# EAGLE design ETHERBEAR (EAGLE 9.6.2)

## Sheet 1 of 4
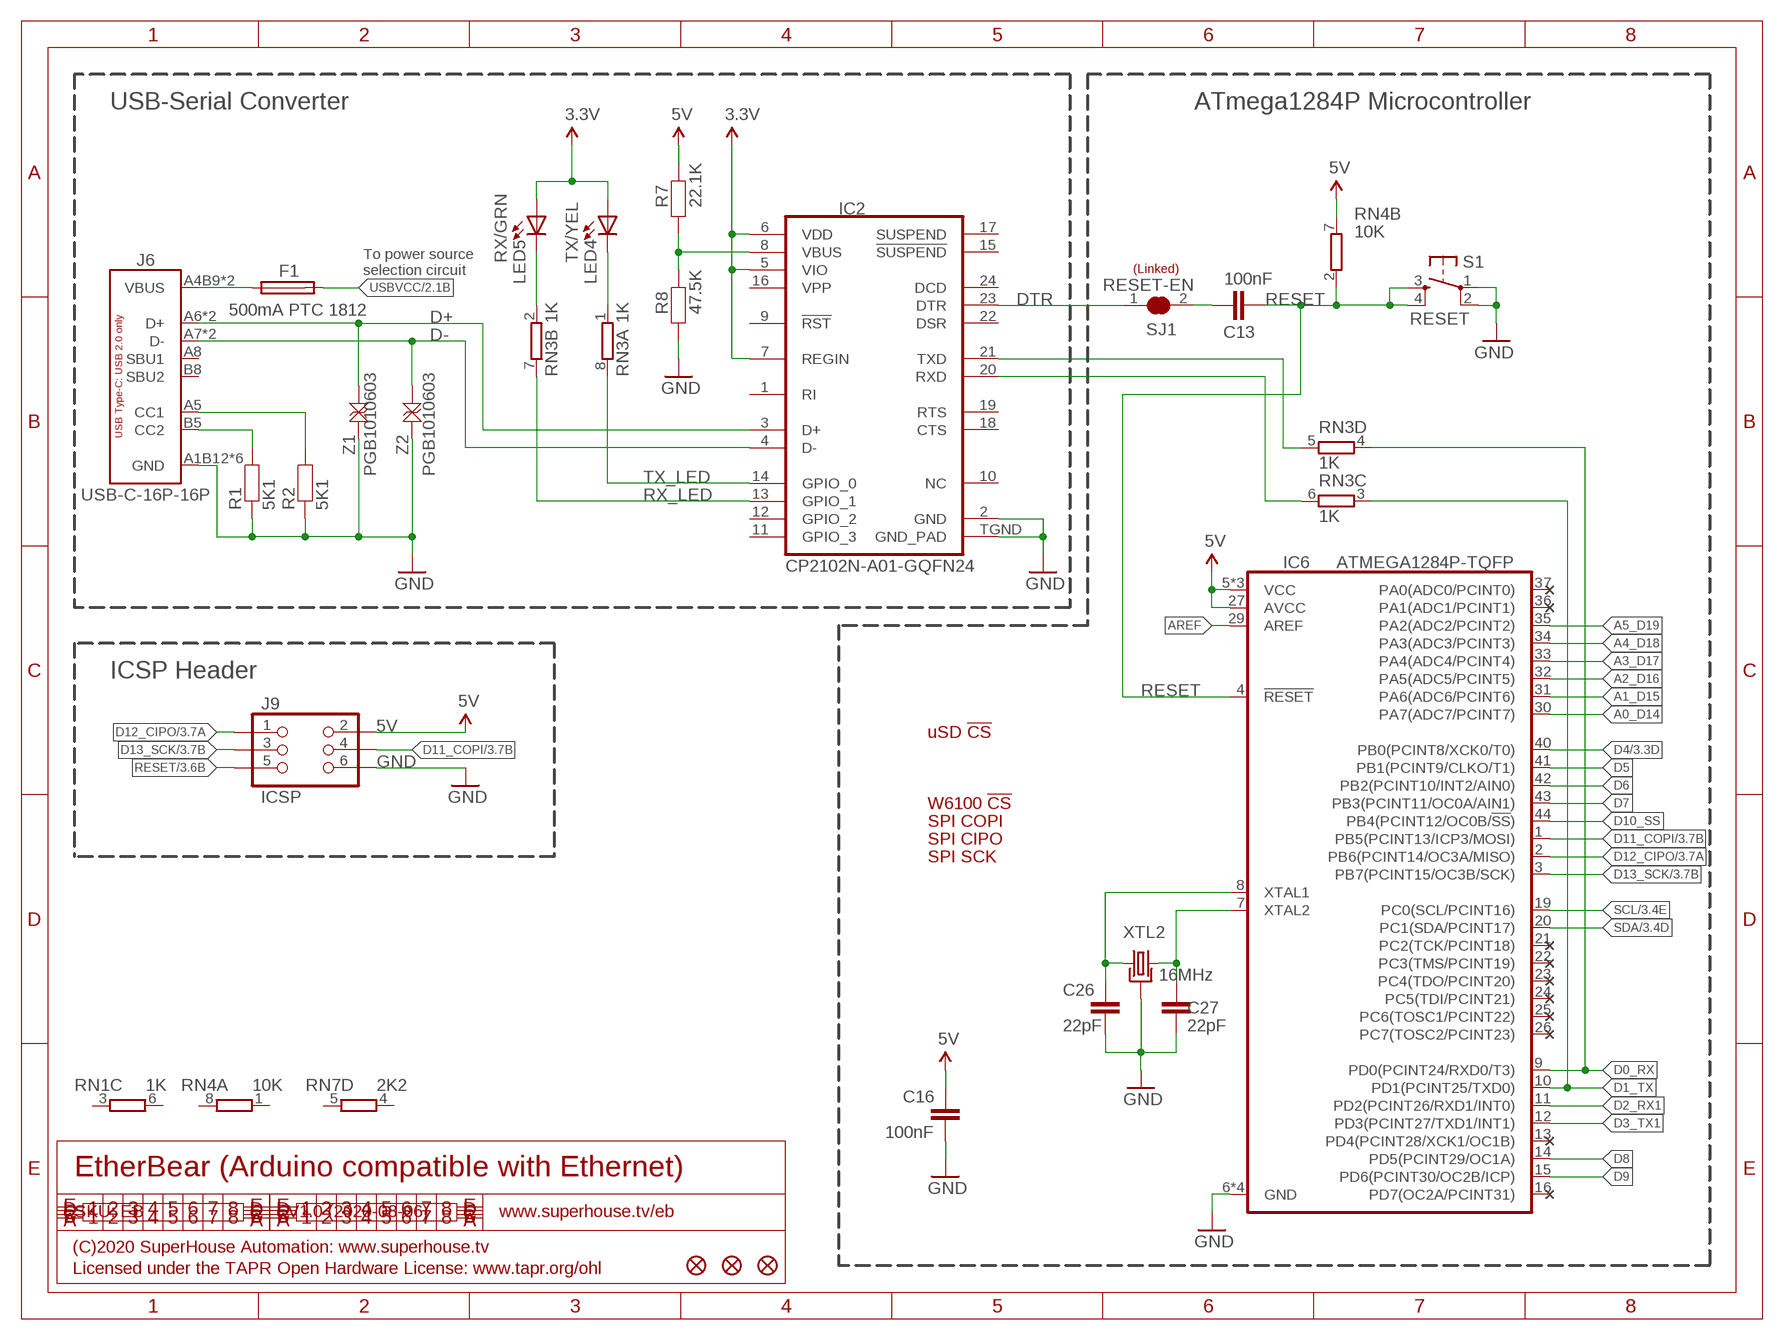
[diagram p0: schematic, sheet 1]

### Parts
C13  100nF  CAP0603  [C0603]
C16  100nF  CAP0603  [C0603]
C26  22pF  CAP0603  [C0603]
C27  22pF  CAP0603  [C0603]
F1  500mA PTC 1812  PTC050  [1812]
FID1  FIDUCIAL1X2.5  [FIDUCIAL-1X2.5]
FID2  FIDUCIAL1X2.5  [FIDUCIAL-1X2.5]
FID3  FIDUCIAL1X2.5  [FIDUCIAL-1X2.5]
IC2  CP2102N-A01-GQFN24  CP2104  [QFN-24]
IC6  ATMEGA1284P-TQFP  [TQFP44]
J6  USB-C-16P-16P  [USB-C-16P]
J9  ICSP  ICSP-PIN  [2X03-ICSP]
LED4  TX/YEL  LED0603  [LED-0603]
LED5  RX/GRN  LED0603  [LED-0603]
R1  5K1  RESISTOR0603  [R0603]
R2  5K1  RESISTOR0603  [R0603]
R7  22.1K  RESISTOR0603  [R0603]
R8  47.5K  RESISTOR0603  [R0603]
RN1  1K  4R-NCAY16  [CAY16]
RN3  1K  4R-NCAY16  [CAY16]
RN4  10K  4R-NCAY16  [CAY16]
RN7  2K2  4R-NCAY16  [CAY16]
S1  RESET  TAC_SWITCH-SMT-6  [TACTILE_SMT-6MM]
SJ1  RESET-EN  SJC-NORMAL  [SJC]
XTL2  16MHz  CRYSTAL-GND3X2  [CRYSTAL-SMD-3X2]
Z1  PGB1010603  TVS0603  [TVS0603]
Z2  PGB1010603  TVS0603  [TVS0603]

### Nets
3.3V: IC2.5(VIO) IC2.6(VDD) IC2.7(REGIN) LED4.A LED5.A ; also sheet 2,3,4
5V [power]: C16.1 IC6.5(VCC) IC6.17(VCC) IC6.27(AVCC) IC6.28(VCC) J9.2 R7.2 RN4.7 ; also sheet 2,3,4
A0_D14: IC6.30(PA7(ADC7/PCINT7)) ; also sheet 4
A1_D15: IC6.31(PA6(ADC6/PCINT6)) ; also sheet 4
A2_D16: IC6.32(PA5(ADC5/PCINT5)) ; also sheet 4
A3_D17: IC6.33(PA4(ADC4/PCINT4)) ; also sheet 4
A4_D18: IC6.34(PA3(ADC3/PCINT3)) ; also sheet 4
A5_D19: IC6.35(PA2(ADC2/PCINT2)) ; also sheet 4
AREF: IC6.29(AREF) ; also sheet 4
D0_RX: IC6.9(PD0(PCINT24/RXD0/T3)) RN3.4 ; also sheet 4
D1_TX: IC6.10(PD1(PCINT25/TXD0)) RN3.3 ; also sheet 4
D2_RX1: IC6.11(PD2(PCINT26/RXD1/INT0)) ; also sheet 4
D3_TX1: IC6.12(PD3(PCINT27/TXD1/INT1)) ; also sheet 4
D4: IC6.40(PB0(PCINT8/XCK0/T0)) ; also sheet 3,4
D5: IC6.41(PB1(PCINT9/CLKO/T1)) ; also sheet 4
D6: IC6.42(PB2(PCINT10/INT2/AIN0)) ; also sheet 4
D7: IC6.43(PB3(PCINT11/OC0A/AIN1)) ; also sheet 4
D8: IC6.14(PD5(PCINT29/OC1A)) ; also sheet 4
D9: IC6.15(PD6(PCINT30/OC2B/ICP)) ; also sheet 4
D10_SS: IC6.44(PB4(PCINT12/OC0B/!SS!))
D11_COPI: IC6.1(PB5(PCINT13/ICP3/MOSI)) J9.4 ; also sheet 3,4
D12_CIPO: IC6.2(PB6(PCINT14/OC3A/MISO)) J9.1 ; also sheet 3,4
D13_SCK: IC6.3(PB7(PCINT15/OC3B/SCK)) J9.3 ; also sheet 3,4
D+: IC2.3(D+) J6.A6(D+) J6.B6(D+) Z1.1
D-: IC2.4(D-) J6.A7(D-) J6.B7(D-) Z2.1
DTR: IC2.23(DTR) SJ1.1
GND: C16.2 C26.1 C27.1 IC2.2(GND) IC2.TGND(GND_PAD) IC6.6(GND) IC6.18(GND) IC6.38(GND) IC6.39(GND) J6.A1B12(GND) J6.A12B1(GND) J6.FIX1(GND) J6.FIX2(GND) J6.FIX3(GND) J6.FIX4(GND) J9.6 R1.1 R2.1 R8.1 S1.1 S1.2 XTL2.2(GND) XTL2.4(GND) Z1.2 Z2.2 ; also sheet 2,3,4
N$2: C26.2 IC6.8(XTAL1) XTL2.1
N$3: C13.1 SJ1.2
N$7: C27.2 IC6.7(XTAL2) XTL2.3
N$10: J6.B5(CC2) R1.2
N$11: LED5.C RN3.2
N$13: LED4.C RN3.1
N$34: J6.A5(CC1) R2.2
N$39: IC2.8(VBUS) R7.1 R8.2
N$115: F1.1 J6.A4B9(VBUS) J6.A9B4(VBUS)
RESET: C13.2 IC6.4(!RESET) J9.5 RN4.2 S1.3 S1.4 ; also sheet 3,4
RX_LED: IC2.13(GPIO_1) RN3.7
SCL: IC6.19(PC0(SCL/PCINT16)) ; also sheet 3,4
SDA: IC6.20(PC1(SDA/PCINT17)) ; also sheet 3,4
TX_LED: IC2.14(GPIO_0) RN3.8
USBRXD: IC2.21(TXD) RN3.5
USBTXD: IC2.20(RXD) RN3.6
USBVCC: F1.2 ; also sheet 2
Unconnected: IC2.1(RI) IC2.9(!RST) IC2.10(NC) IC2.11(GPIO_3) IC2.12(GPIO_2) IC2.15(!SUSPEND) IC2.16(VPP) IC2.17(SUSPEND) IC2.18(CTS) IC2.19(RTS) IC2.22(DSR) IC2.24(DCD) IC6.13(PD4(PCINT28/XCK1/OC1B)) IC6.16(PD7(OC2A/PCINT31)) IC6.21(PC2(TCK/PCINT18)) IC6.22(PC3(TMS/PCINT19)) IC6.23(PC4(TDO/PCINT20)) IC6.24(PC5(TDI/PCINT21)) IC6.25(PC6(TOSC1/PCINT22)) IC6.26(PC7(TOSC2/PCINT23)) IC6.36(PA1(ADC1/PCINT1)) IC6.37(PA0(ADC0/PCINT0)) J6.A8(SBU1) J6.B8(SBU2) RN1.3 RN1.6 RN4.1 RN4.8 RN7.4 RN7.5

### Notes on the sheet
- USB-Serial Converter | ATmega1284P Microcontroller
- (Linked)
- To power source
  selection circuit
- ICSP Header
- uSD !CS
- W6100 !CS
- SPI COPI
- SPI CIPO
- SPI SCK
- EtherBear (Arduino compatible with Ethernet)
- SKU: EB | V1.0 (2020-08-06) | www.superhouse.tv/eb
- (C)2020 SuperHouse Automation: www.superhouse.tv
- Licensed under the TAPR Open Hardware License: www.tapr.org/ohl

## Sheet 2 of 4
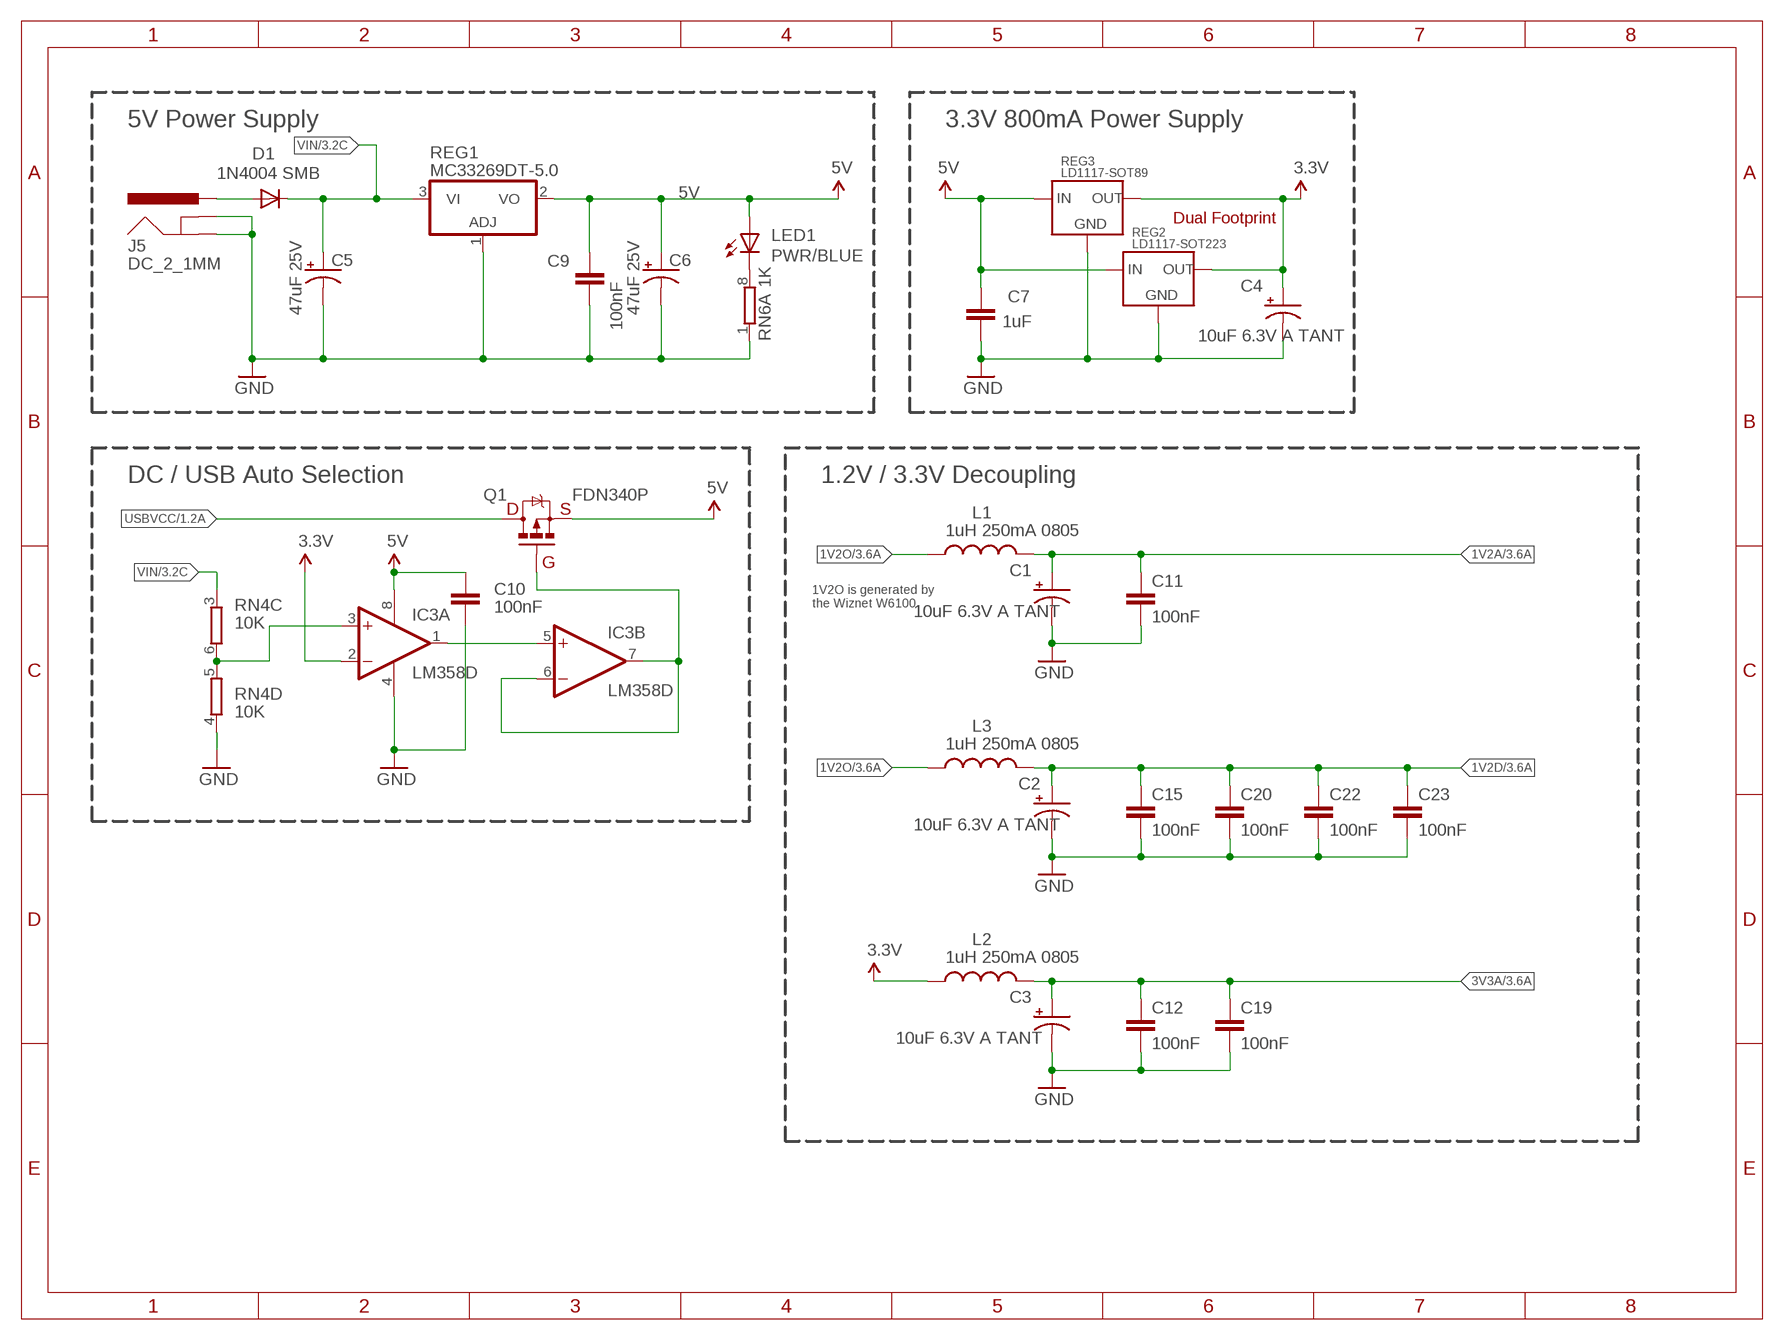
[diagram p1: schematic, sheet 2]

### Parts
C1  10uF 6.3V A TANT  CAP_POL1206  [EIA3216]
C2  10uF 6.3V A TANT  CAP_POL1206  [EIA3216]
C3  10uF 6.3V A TANT  CAP_POL1206  [EIA3216]
C4  10uF 6.3V A TANT  CAP_POL1206  [EIA3216]
C5  47uF 25V  CAP_POLD  [PANASONIC_D]
C6  47uF 25V  CAP_POLD  [PANASONIC_D]
C7  1uF  CAP0603  [C0603]
C9  100nF  CAP0603  [C0603]
C10  100nF  CAP0603  [C0603]
C11  100nF  CAP0603  [C0603]
C12  100nF  CAP0603  [C0603]
C15  100nF  CAP0603  [C0603]
C19  100nF  CAP0603  [C0603]
C20  100nF  CAP0603  [C0603]
C22  100nF  CAP0603  [C0603]
C23  100nF  CAP0603  [C0603]
D1  1N4004 SMB  DIODESMA  [SMA-DIODE]
IC3  LM358D  [SO08]
J5  DC_2_1MM  POWER_JACK-SLOTS  [POWER_JACK_SLOTS]
L1  1uH 250mA 0805  INDUCTOR0805-LARGE  [0805-LARGE]
L2  1uH 250mA 0805  INDUCTOR0805-LARGE  [0805-LARGE]
L3  1uH 250mA 0805  INDUCTOR0805-LARGE  [0805-LARGE]
LED1  PWR/BLUE  LED0603  [LED-0603]
Q1  FDN340P  MOSFET-PCHANNEL  [SOT23]
REG1  MC33269DT-5.0  MC33269-X-5.0-D  [DPACK]
REG2  LD1117-SOT223  [SOT-223]
REG3  LD1117-SOT89  [SOT89]
RN6  1K  4R-NCAY16  [CAY16]

### Nets
1V2A: C1.A(+) C11.1 L1.2 ; also sheet 3
1V2D: C2.A(+) C15.1 C20.1 C22.1 C23.1 L3.2 ; also sheet 3
1V2O: L1.1 L3.1 ; also sheet 3
3.3V: C4.A(+) IC3.2(A:-IN) L2.1 REG2.2(OUT) REG2.4(OUT) REG3.2(OUT) REG3.4(OUT) ; also sheet 1,3,4
3V3A: C3.A(+) C12.1 C19.1 L2.2 ; also sheet 3
5V [power]: C6.+ C7.1 C9.1 C10.1 IC3.8(P:V+) LED1.A Q1.2(S) REG1.2(VO) REG2.3(IN) REG3.3(IN) ; also sheet 1,3,4
GND: C1.C(-) C2.C(-) C3.C(-) C4.C(-) C5.- C6.- C7.2 C9.2 C10.2 C11.2 C12.2 C15.2 C19.2 C20.2 C22.2 C23.2 IC3.4(P:V-) J5.GND J5.GNDBREAK REG1.1(ADJ) REG2.1(GND) REG3.1(GND) RN4.4 RN6.1 ; also sheet 1,3,4
N$12: IC3.3(A:+IN) RN4.5 RN4.6
N$14: LED1.C RN6.8
N$18: IC3.6(B:-IN) IC3.7(B:OUT) Q1.1(G)
N$19: IC3.1(A:OUT) IC3.5(B:+IN)
N$60: D1.A J5.PWR
USBVCC: Q1.3(D) ; also sheet 1
VIN: C5.+ D1.C REG1.3(VI) RN4.3 ; also sheet 3,4

### Notes on the sheet
- 5V Power Supply | 3.3V 800mA Power Supply
- Dual Footprint
- DC / USB Auto Selection | 1.2V / 3.3V Decoupling
- D | S
- G
- 1V2O is generated by
  the Wiznet W6100

## Sheet 3 of 4
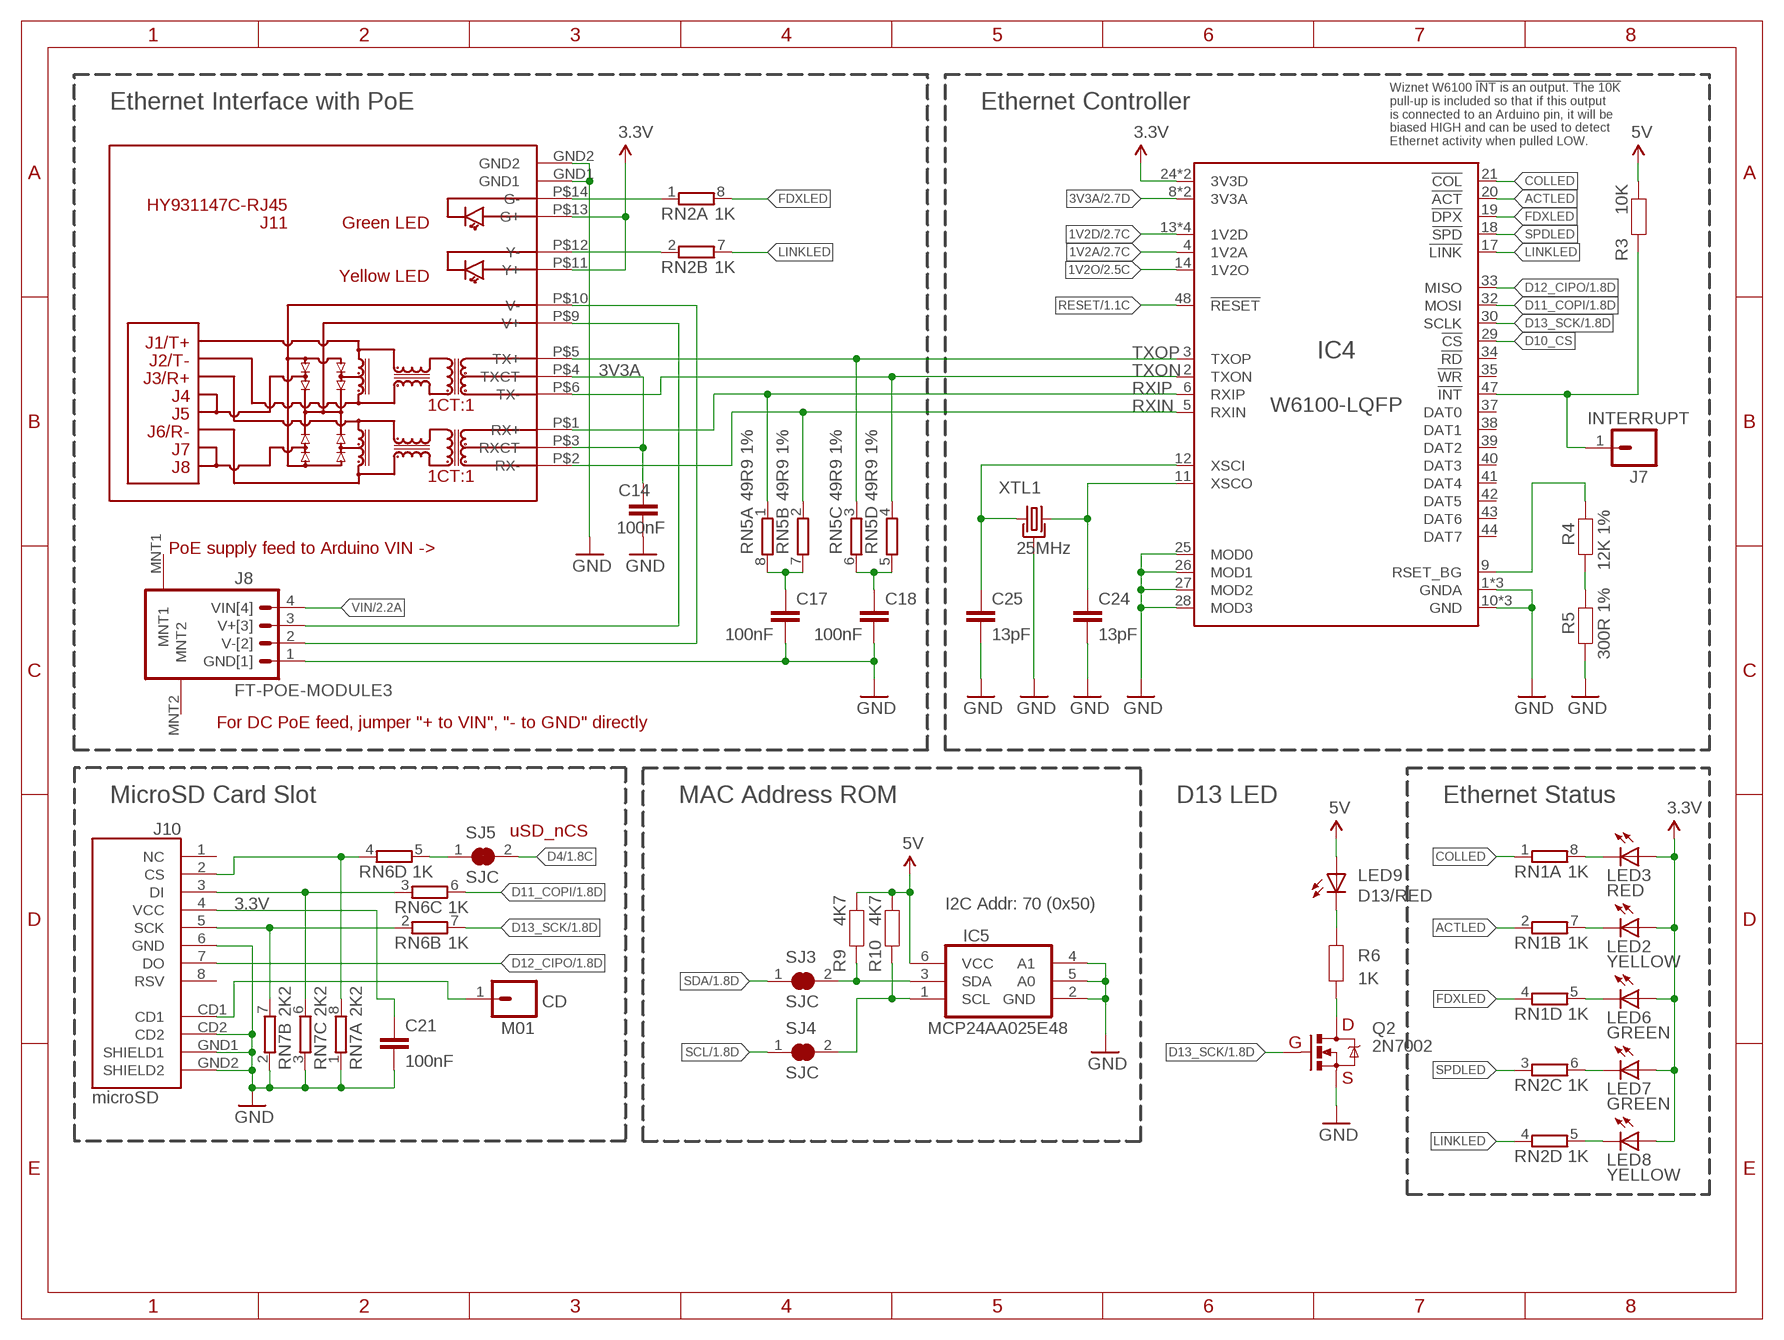
[diagram p2: schematic, sheet 3]

### Parts
C14  100nF  CAP0603  [C0603]
C17  100nF  CAP0603  [C0603]
C18  100nF  CAP0603  [C0603]
C21  100nF  CAP0603  [C0603]
C24  13pF  CAP0603  [C0603]
C25  13pF  CAP0603  [C0603]
CD  M01  M01-PLAIN  [1X01]
IC4  W6100-LQFP  [LQFP48]
IC5  MCP24AA025E48  [SOT23-6]
J7  INTERRUPT  M01-PLAIN  [1X01]
J8  FT-POE-MODULE3  [FT-POE-MODULE-NOLABEL]
J10  microSD  USD-SOCKETNEW  [MICRO-SD-SOCKET-PP]
J11  HY931147C-RJ45  [HY931147C]
LED2  YELLOW  LED0603  [LED-0603]
LED3  RED  LED0603  [LED-0603]
LED6  GREEN  LED0603  [LED-0603]
LED7  GREEN  LED0603  [LED-0603]
LED8  YELLOW  LED0603  [LED-0603]
LED9  D13/RED  LED0603  [LED-0603]
Q2  2N7002  MOSFET-NCHANNEL-233  [SOT23-3]
R3  10K  RESISTOR0603  [R0603]
R4  12K 1%  RESISTOR0603  [R0603]
R5  300R 1%  RESISTOR0603  [R0603]
R6  1K  RESISTOR0603  [R0603]
R9  4K7  RESISTOR0603  [R0603]
R10  4K7  RESISTOR0603  [R0603]
RN2  1K  4R-NCAY16  [CAY16]
RN5  49R9 1%  4R-NCAY16  [CAY16]
SJ3  SJC  SJC-NORMAL  [SJC]
SJ4  SJC  SJC-NORMAL  [SJC]
SJ5  SJC  SJC-NORMAL  [SJC]
XTL1  25MHz  CRYSTAL-GND3X2  [CRYSTAL-SMD-3X2]

### Nets
1V2A: IC4.4(1V2A) ; also sheet 2
1V2D: IC4.13(1V2D) IC4.22(1V2D) IC4.31(1V2D) IC4.45(1V2D) ; also sheet 2
1V2O: IC4.14(1V2O) ; also sheet 2
3.3V: C21.1 IC4.24(3V3D) IC4.36(3V3D) J10.4(VCC) J11.P$11(Y+) J11.P$13(G+) LED2.A LED3.A LED6.A LED7.A LED8.A ; also sheet 1,2,4
3V3A: C14.1 IC4.8(3V3A) IC4.15(3V3A) J11.P$3(RXCT) J11.P$4(TXCT) ; also sheet 2
5V [power]: IC5.6(VCC) LED9.A R3.1 R9.1 R10.1 ; also sheet 1,2,4
ACTLED: IC4.20(!ACT) RN1.2
COLLED: IC4.21(!COL) RN1.1
D4: SJ5.2 ; also sheet 1,4
D10_CS: IC4.29(!CS) ; also sheet 4
D11_COPI: IC4.32(MOSI) RN6.6 ; also sheet 1,4
D12_CIPO: IC4.33(MISO) J10.7(DO) ; also sheet 1,4
D13_SCK: IC4.30(SCLK) Q2.1(G) RN6.7 ; also sheet 1,4
FDXLED: IC4.19(!DPX) RN1.4 RN2.8
GND: C14.2 C17.2 C18.2 C21.2 C24.2 C25.2 IC4.1(GNDA) IC4.7(GNDA) IC4.10(GND) IC4.16(GNDA) IC4.23(GND) IC4.25(MOD0) IC4.26(MOD1) IC4.27(MOD2) IC4.28(MOD3) IC4.46(GND) IC5.2(GND) IC5.4(A1) IC5.5(A0) J8.1(GND[1]) J10.6(GND) J10.CD2 J10.GND1(SHIELD1) J10.GND2(SHIELD2) J11.GND1 J11.GND2 Q2.2(S) R5.2 RN7.1 RN7.2 RN7.3 XTL1.2(GND) XTL1.4(GND) ; also sheet 1,2,4
LINKLED: IC4.17(!LINK) RN2.4 RN2.7
N$1: C18.1 RN5.5 RN5.6
N$4: LED9.C R6.2
N$5: IC5.1(SCL) R10.2 SJ4.2
N$6: Q2.3(D) R6.1
N$8: LED3.C RN1.8
N$9: IC4.47(!INT) J7.1 R3.2
N$20: J10.2(CS) RN6.4 RN7.8
N$23: CD.1 J10.CD1
N$24: J10.5(SCK) RN6.2 RN7.7
N$25: J10.3(DI) RN6.3 RN7.6
N$26: LED7.C RN2.6
N$27: RN6.5 SJ5.1
N$28: LED8.C RN2.5
N$29: IC5.3(SDA) R9.2 SJ3.2
N$30: C24.1 IC4.11(XSCO) XTL1.3
N$32: C25.1 IC4.12(XSCI) XTL1.1
N$35: R4.2 R5.1
N$36: IC4.9(RSET_BG) R4.1
N$67: J11.P$14(G-) RN2.1
N$68: J8.3(V+[3]) J11.P$9(V+)
N$69: J8.2(V-[2]) J11.P$10(V-)
N$321: C17.1 RN5.7 RN5.8
N$327: LED6.C RN1.5
N$329: LED2.C RN1.7
N$332: J11.P$12(Y-) RN2.2
RESET: IC4.48(!RESET) ; also sheet 1,4
RXIN: IC4.5(RXIN) J11.P$2(RX-) RN5.2
RXIP: IC4.6(RXIP) J11.P$1(RX+) RN5.1
SCL: SJ4.1 ; also sheet 1,4
SDA: SJ3.1 ; also sheet 1,4
SPDLED: IC4.18(!SPD) RN2.3
TXON: IC4.2(TXON) J11.P$6(TX-) RN5.4
TXOP: IC4.3(TXOP) J11.P$5(TX+) RN5.3
VIN: J8.4(VIN[4]) ; also sheet 2,4
Unconnected: IC4.34(!RD) IC4.35(!WR) IC4.37(DAT0) IC4.38(DAT1) IC4.39(DAT2) IC4.40(DAT3) IC4.41(DAT4) IC4.42(DAT5) IC4.43(DAT6) IC4.44(DAT7) J8.MNT1 J8.MNT2 J10.1(NC) J10.8(RSV)

### Notes on the sheet
- Ethernet Interface with PoE | Ethernet Controller
- Wiznet W6100 !INT is an output. The 10K
  pull-up is included so that if this output
  is connected to an Arduino pin, it will be
  biased HIGH and can be used to detect
  Ethernet activity when pulled LOW.
- PoE supply feed to Arduino VIN ->
- For DC PoE feed, jumper "+ to VIN", "- to GND" directly
- MicroSD Card Slot | MAC Address ROM | D13 LED | Ethernet Status
- uSD_nCS
- I2C Addr: 70 (0x50)
- D
- G
- S

## Sheet 4 of 4
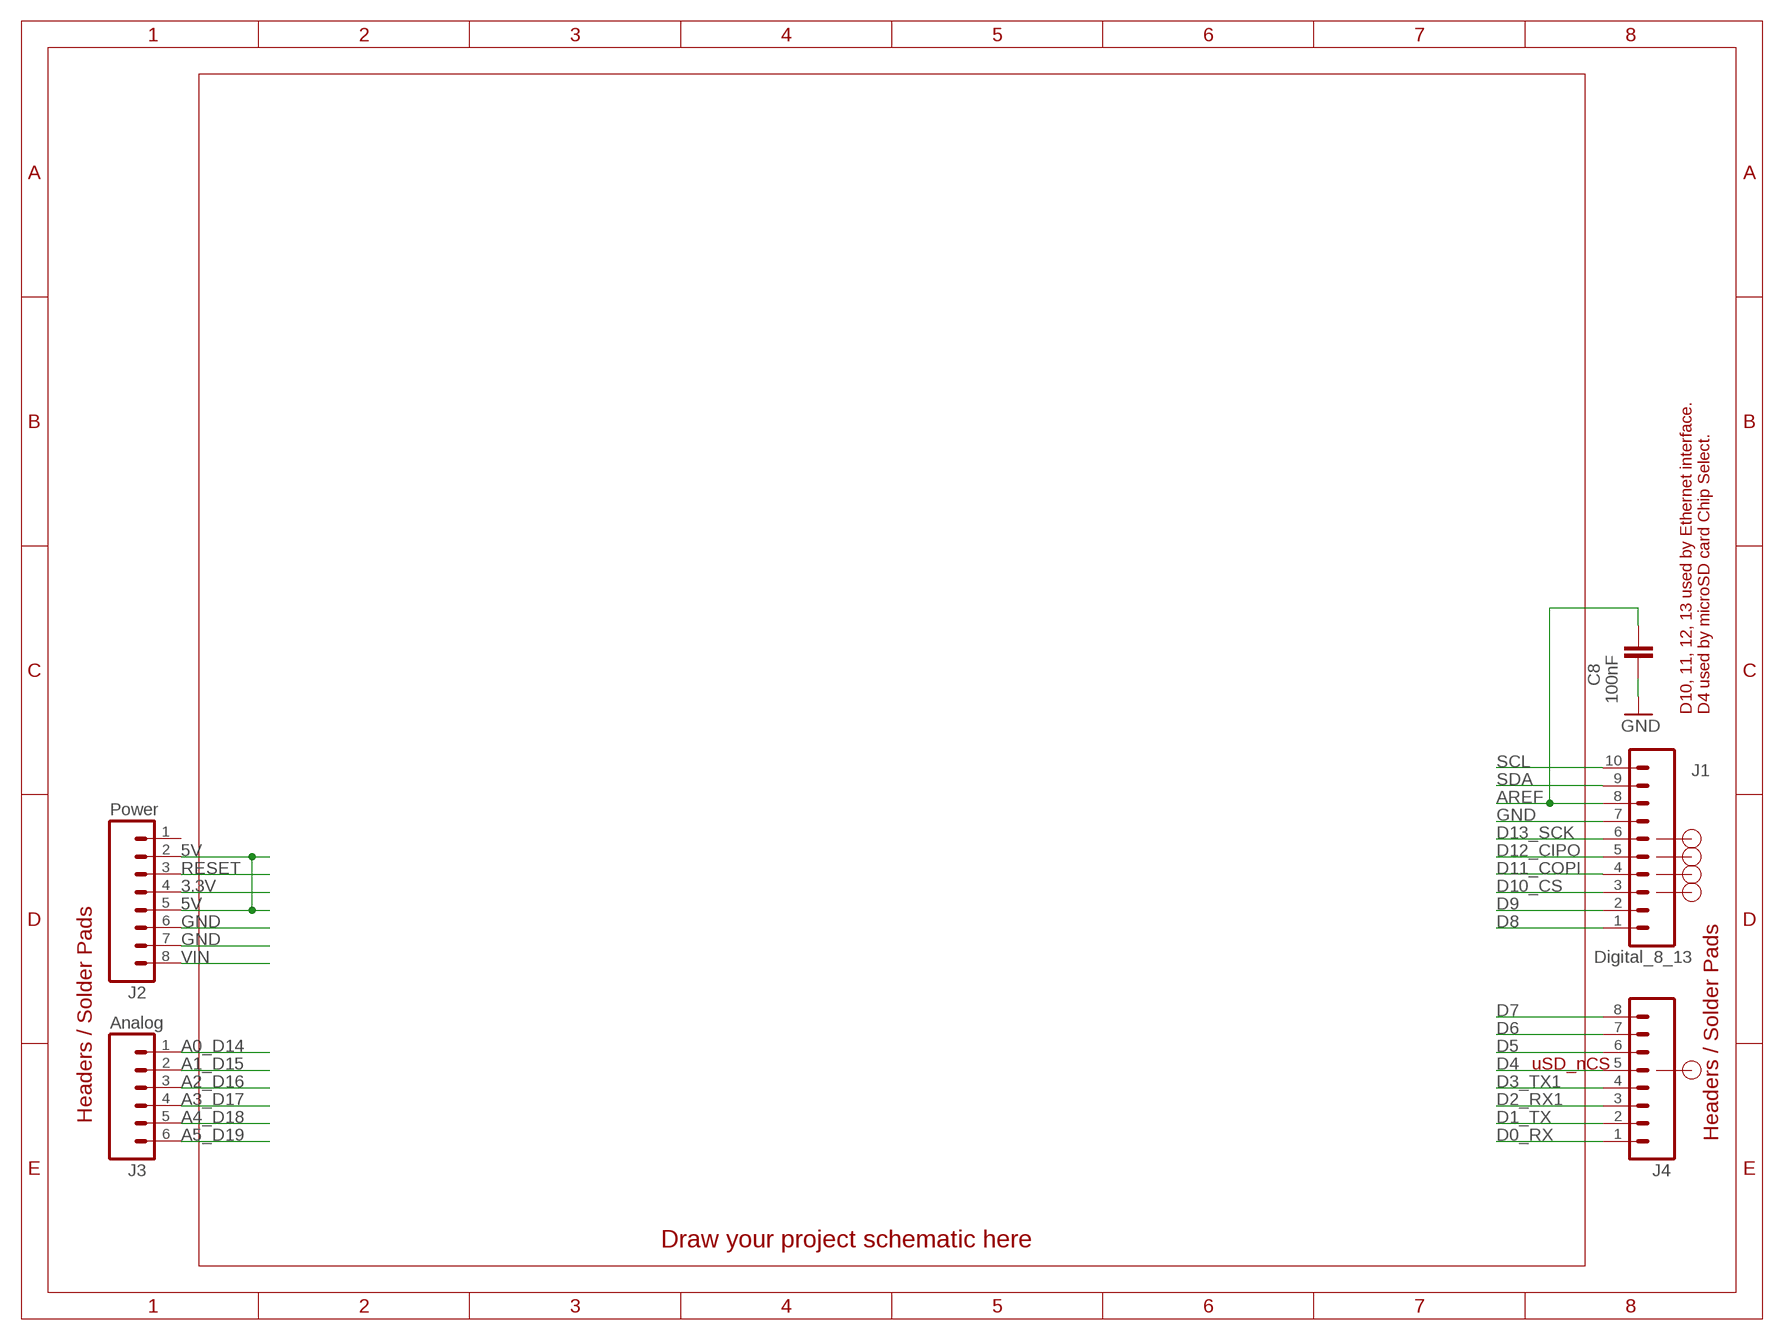
[diagram p3: schematic, sheet 4]

### Parts
C8  100nF  CAP0603  [C0603]
J1  Digital_8_13  M10-SOCKET  [1X10-S]
J2  Power  M08-SOCKET  [1X08-S]
J3  Analog  M06-SOCKET  [1X06-S]
J4  Digital_0_7  M08-SOCKET  [1X08-S]

### Nets
3.3V: J2.4 ; also sheet 1,2,3
5V [power]: J2.2 J2.5 ; also sheet 1,2,3
A0_D14: J3.1 ; also sheet 1
A1_D15: J3.2 ; also sheet 1
A2_D16: J3.3 ; also sheet 1
A3_D17: J3.4 ; also sheet 1
A4_D18: J3.5 ; also sheet 1
A5_D19: J3.6 ; also sheet 1
AREF: C8.1 J1.8 ; also sheet 1
D0_RX: J4.1 ; also sheet 1
D1_TX: J4.2 ; also sheet 1
D2_RX1: J4.3 ; also sheet 1
D3_TX1: J4.4 ; also sheet 1
D4: J4.5 ; also sheet 1,3
D5: J4.6 ; also sheet 1
D6: J4.7 ; also sheet 1
D7: J4.8 ; also sheet 1
D8: J1.1 ; also sheet 1
D9: J1.2 ; also sheet 1
D10_CS: J1.3 ; also sheet 3
D11_COPI: J1.4 ; also sheet 1,3
D12_CIPO: J1.5 ; also sheet 1,3
D13_SCK: J1.6 ; also sheet 1,3
GND: C8.2 J1.7 J2.6 J2.7 ; also sheet 1,2,3
RESET: J2.3 ; also sheet 1,3
SCL: J1.10 ; also sheet 1,3
SDA: J1.9 ; also sheet 1,3
VIN: J2.8 ; also sheet 2,3
Unconnected: J2.1

### Notes on the sheet
- D10, 11, 12, 13 used by Ethernet interface. | D4 used by microSD card Chip Select.
- uSD_nCS
- Headers / Solder Pads
- Headers / Solder Pads
- Draw your project schematic here

## Library data of the parts
C1-C6 = SuperHouse-DiscreteSemi:CAP_POL: Capacitor Polarized These are standard SMD and PTH capacitors. Normally 10uF, 47uF, and 100uF in electrolytic and tantalum varieties. Always verify the external diameter of the through hole cap, it varies with capacity, voltage, and manufacturer. The EIA devices should be standard.
C7-C27 = SuperHouse-DiscreteSemi:CAP: Capacitor Standard ceramic capacitor
CD J7 = SuperHouse-Connectors:M01: 1-way header Standard 1x1 header
D1 = SuperHouse-DiscreteSemi:DIODE: Diode Standard reverse protection diodes and small signal diodes. SMA package can handle up to about 1A. SOD-323 can handle about 200mA.
F1 = SuperHouse-Fuses:PTC: MF-SMDF Series - PRC Resettable Fuses Source: http://www.farnell.com/datasheets/716597.pdf
FID1-FID3 = SuperHouse-Symbols:FIDUCIAL: Fiducial Alignment Points Various fiducial points for machine vision alignment.
IC2 = SuperHouse-ICs:CP2104: CP2104 / CP2102N-A01-GQFN24 CP2104 USB to serial converter. The CP2104 is not recommended for new designs: replace with CP2102N-A01-GQFN24.
IC3 = linear:LM358: OP AMP also LM158; LM258; LM2904 Source: http://cache.national.com/ds/LM/LM158.pdf
IC4 = SuperHouse-ICs:W6100: Wiznet W6100 Ethernet controller
IC5 = freetronics-jon:MCP24AA025E48
IC6 = SuperHouse-MCUs:ATMEGA1284P: Microchip ATmega1284P AVR MCU
J1 = SuperHouse-Connectors:M10: 10-way header Standard 1x10 header, and screw terminal variations
J2 J4 = SuperHouse-Connectors:M08: 8-way header Standard 1x8 header, and screw terminal variations
J3 = SuperHouse-Connectors:M06: 6-way header Standard 1x6 header, and screw terminal variations
J5 = SuperHouse-Connectors:POWER_JACK: Power Jack This is the standard 5.5mm barrel jack for power. The PTH is the most common, proven, reliable, footprint. All others are experimental. The Slot footprint only works if the mill layer is transmitted to the PCB fab house so be warned. Spark Fun Electronics SKU : PRT-00119. Mating wall wart : TOL-00298 (and others)
J6 = SuperHouse-Connectors:USB-C-16P: USB-C socket with 16 pins, suitable only for backward compatibility with USB 2
J8 = freetronics-master-v1.1:FT-POE-MODULE
J9 = SuperHouse-Connectors:ICSP
J10 = SuperHouse-Connectors:USD-SOCKET: microSD Socket Push-push type uSD socket. Schematic element and footprint production proven. Spark Fun Electronics SKU : PRT-00127. tDoc lines correctly indicate media card edge positions when inserting (unlocked, locked, depressed).
J11 = SuperHouse-Connectors:HY931147C: Hanrun RJ45 socket HY931147C
L1-L3 = SuperHouse-DiscreteSemi:INDUCTOR: Inductors Basic Inductor/Choke - 0603 and 1206. Footprints are not proven and vary greatly between part numbers.
LED1-LED9 = SuperHouse-LEDs:LED: LEDs Standard schematic elements and footprints for 5mm, 3mm, 1206, and 0603 sized LEDs. 5mm - Spark Fun Electronics SKU : COM-00529 (and others)
Q1 = freetronics-master-v1:MOSFET-PCHANNEL
Q2 = SuperHouse-DiscreteSemi:MOSFET-NCHANNEL: N-channel MOSFET
R1-R10 = SuperHouse-DiscreteSemi:RESISTOR: Resistor Standard resistors.
REG1 = SuperHouse-Regulators:MC33269-X: Adjustable Output Low Dropout Voltage Regulator 800 mA Source: http://www.onsemi.com/pub/Collateral/MC33269-D.PDF
REG2 REG3 = SuperHouse-Regulators:LD1117: Fixed-voltage LD1117 series LDOs. Note that the ground pin is labelled as ground, not as adj, because it's not the adjustable-voltage part.
RN1-RN7 = SuperHouse-DiscreteSemi:4R-N: Array Chip Resistor Source: RS Component / Phycomp
S1 = SuperHouse-Switches:TAC_SWITCH: Momentary Switch Tactile switch, normally-open.
SJ1 SJ3-SJ5 = SuperHouse-Jumpers:SJC: Solder jumper. Normally closed: does not need solder to close. Can be opened by cutting the track.
XTL1 XTL2 = SuperHouse-Oscillators:CRYSTAL-GND: 3x2mm SMT crystal
Z1 Z2 = SuperHouse-DiscreteSemi:TVS: TVS voltage protection Zener

## Board
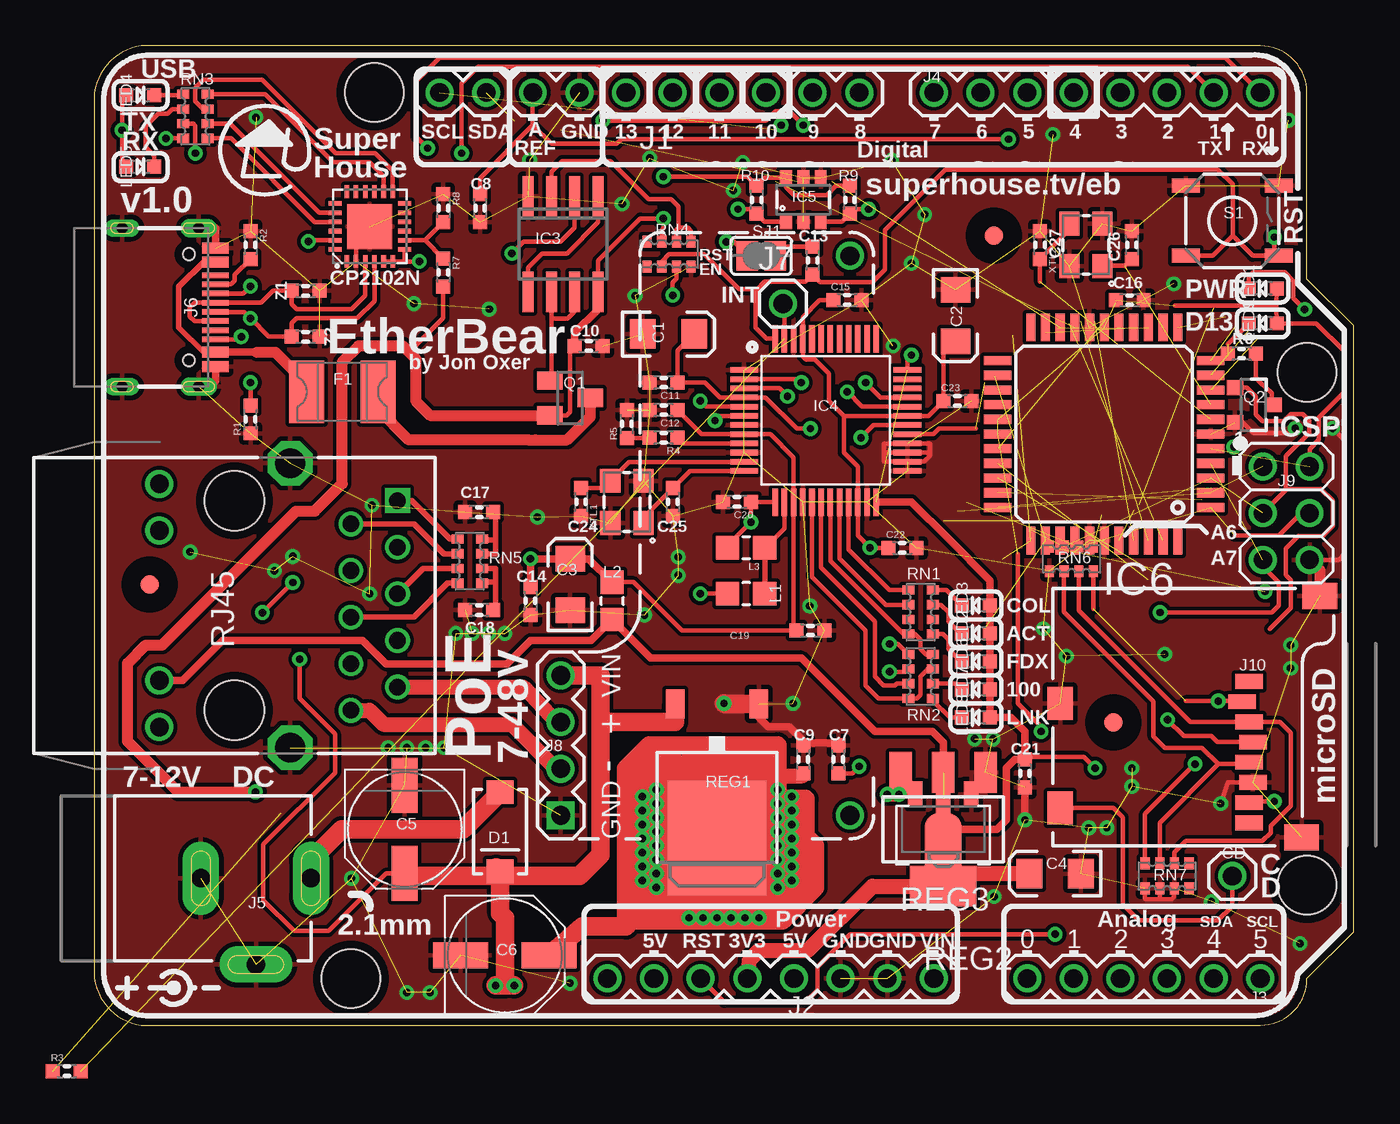
[diagram p4: board, top side]
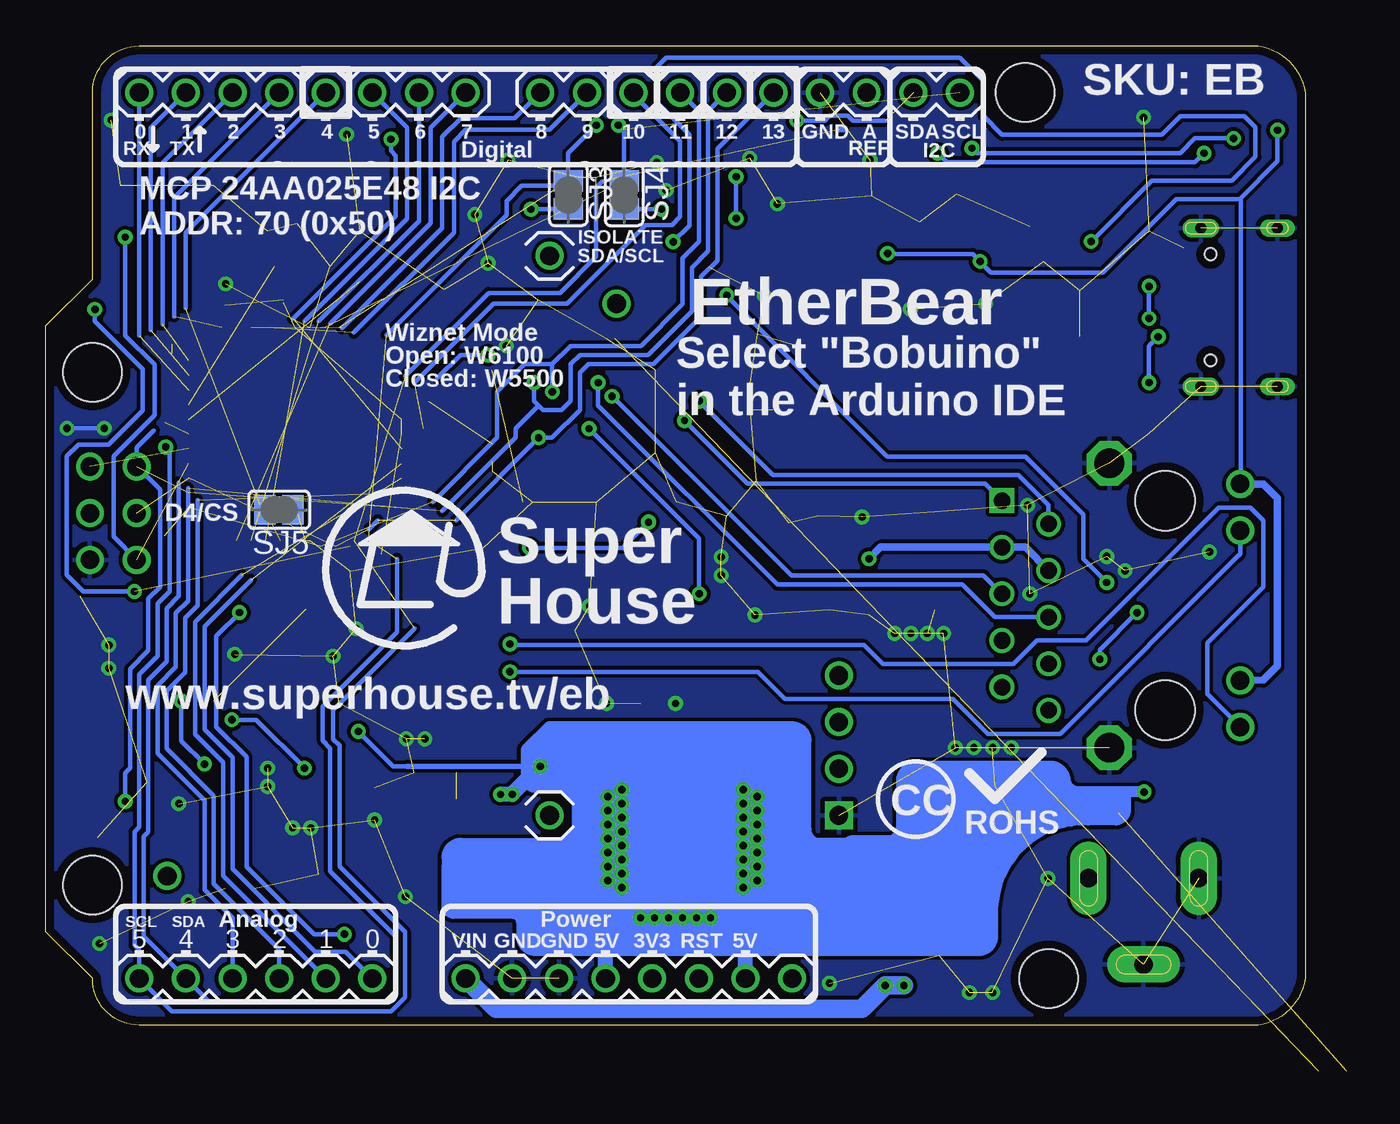
[diagram p5: board, bottom side, seen from below]

Size 68.58 x 53.34 mm. Coordinates in mm from the lower left corner, seen from the top.
Outline: 0,2.54 arc74 2.54,0 63.5,0 arc90 66.04,2.54 68.58,5.08 68.58,38.1 66.04,40.64 66.04,50.8 arc90 63.5,53.34 2.54,53.34 arc74 0,50.8 0,2.54
Copper layers (1*16): Top 0.035mm / dielectric 1.5mm / Bottom 0.035mm
Design rules "SuperHouse-Design-Rules": minimum track width 10mil, minimum drill 24mil, track to track 8mil, track to pad 8mil, pad to pad 8mil, via to via 8mil, smd to smd 6mil, copper to edge 18mil, drill to drill 8mil, minimum pad ring 7mil, minimum via ring 8mil, stop-mask expansion 4mil, vias tented up to drill 0.5mm, thermal gap 10mil
Holes 3.2 mm at 66.04,35.56 66.04,7.62 13.97,2.54 15.24,50.8
tRestrict: area 48,42 to 50,44; area 54.5,15.5 to 56.5,17.5; area 2,23 to 4,25

### Footprints (pad centres in the part's own frame; a part is rotated, then mirrored left to right if it is on the bottom)
EIA3216 = smd 1.4 x 1.6: A 1.4,0; C -1.4,0
PANASONIC_D = smd 3 x 1.4: + 2.4,0; - -2.4,0
C0603 = smd 0.762 x 0.762: 1 -0.762,0; 2 0.762,0
1X01 = drill 1.016: 1 0,0
SMA-DIODE = smd 1.27 x 1.47: A -2.15,0; C 2.15,0
1812 = smd 1.9 x 3.4: 1 -1.95,0; 2 1.95,0
FIDUCIAL-1X2.5 = smd 1 x 1: 1 0,0
QFN-24 = smd 0.25 x 0.7: 1 -1.25,-1.9; 2 -0.75,-1.9; 3 -0.25,-1.9; 4 0.25,-1.9; 5 0.75,-1.9; 6 1.25,-1.9; 13 1.25,1.9; 14 0.75,1.9; 15 0.25,1.9; 16 -0.25,1.9; 17 -0.75,1.9; 18 -1.25,1.9 | smd 0.7 x 0.25: 7 1.9,-1.25; 8 1.9,-0.75; 9 1.9,-0.25; 10 1.9,0.25; 11 1.9,0.75; 12 1.9,1.25; 19 -1.9,1.25; 20 -1.9,0.75; 21 -1.9,0.25; 22 -1.9,-0.25; 23 -1.9,-0.75; 24 -1.9,-1.25 | smd 2.45 x 2.45: TGND 0,0
SO08 = smd 0.6 x 2.2: 1 -1.905,-2.6; 2 -0.635,-2.6; 3 0.635,-2.6; 4 1.905,-2.6; 5 1.905,2.6; 6 0.635,2.6; 7 -0.635,2.6; 8 -1.905,2.6
LQFP48 = smd 1.5 x 0.3: 1 -4.45,2.75; 2 -4.45,2.25; 3 -4.45,1.75; 4 -4.45,1.25; 5 -4.45,0.75; 6 -4.45,0.25; 7 -4.45,-0.25; 8 -4.45,-0.75; 9 -4.45,-1.25; 10 -4.45,-1.75; 11 -4.45,-2.25; 12 -4.45,-2.75; 25 4.45,-2.75; 26 4.45,-2.25; 27 4.45,-1.75; 28 4.45,-1.25; 29 4.45,-0.75; 30 4.45,-0.25; 31 4.45,0.25; 32 4.45,0.75; 33 4.45,1.25; 34 4.45,1.75; 35 4.45,2.25; 36 4.45,2.75 | smd 0.3 x 1.5: 13 -2.75,-4.45; 14 -2.25,-4.45; 15 -1.75,-4.45; 16 -1.25,-4.45; 17 -0.75,-4.45; 18 -0.25,-4.45; 19 0.25,-4.45; 20 0.75,-4.45; 21 1.25,-4.45; 22 1.75,-4.45; 23 2.25,-4.45; 24 2.75,-4.45; 37 2.75,4.45; 38 2.25,4.45; 39 1.75,4.45; 40 1.25,4.45; 41 0.75,4.45; 42 0.25,4.45; 43 -0.25,4.45; 44 -0.75,4.45; 45 -1.25,4.45; 46 -1.75,4.45; 47 -2.25,4.45; 48 -2.75,4.45
SOT23-6 = smd 0.65 x 0.8: 1 -0.95,-1.2; 2 0,-1.2; 3 0.95,-1.2; 4 0.95,1.2; 5 0,1.2; 6 -0.95,1.2
TQFP44 = smd 1.5 x 0.5: 1 -5.8,4; 2 -5.8,3.2; 3 -5.8,2.4; 4 -5.8,1.6; 5 -5.8,0.8; 6 -5.8,0; 7 -5.8,-0.8; 8 -5.8,-1.6; 9 -5.8,-2.4; 10 -5.8,-3.2; 11 -5.8,-4; 23 5.8,-4; 24 5.8,-3.2; 25 5.8,-2.4; 26 5.8,-1.6; 27 5.8,-0.8; 28 5.8,0; 29 5.8,0.8; 30 5.8,1.6; 31 5.8,2.4; 32 5.8,3.2; 33 5.8,4 | smd 0.5 x 1.5: 12 -4,-5.8; 13 -3.2,-5.8; 14 -2.4,-5.8; 15 -1.6,-5.8; 16 -0.8,-5.8; 17 0,-5.8; 18 0.8,-5.8; 19 1.6,-5.8; 20 2.4,-5.8; 21 3.2,-5.8; 22 4,-5.8; 34 4,5.8; 35 3.2,5.8; 36 2.4,5.8; 37 1.6,5.8; 38 0.8,5.8; 39 0,5.8; 40 -0.8,5.8; 41 -1.6,5.8; 42 -2.4,5.8; 43 -3.2,5.8; 44 -4,5.8
1X10-S = drill 1.016: 1 -11.43,0; 2 -8.89,0; 3 -6.35,0; 4 -3.81,0; 5 -1.27,0; 6 1.27,0; 7 3.81,0; 8 6.35,0; 9 8.89,0; 10 11.43,0
1X08-S = drill 1.016: 1 -8.89,0; 2 -6.35,0; 3 -3.81,0; 4 -1.27,0; 5 1.27,0; 6 3.81,0; 7 6.35,0; 8 8.89,0
1X06-S = drill 1.016: 1 -6.35,0; 2 -3.81,0; 3 -1.27,0; 4 1.27,0; 5 3.81,0; 6 6.35,0
POWER_JACK_SLOTS = drill 1 pad 2 long: GND 0,7.7; GNDBREAK 4.7,10.7; PWR 0,13.7
USB-C-16P = smd 0.6 x 1.45: A1B12 -3.225,5.095; A4B9 -2.45,5.095; A9B4 2.45,5.095; A12B1 3.225,5.095 | smd 0.3 x 1.45: A5 -1.25,5.095; A6 -0.25,5.095; A7 0.25,5.095; A8 1.25,5.095; B5 1.75,5.095; B6 0.75,5.095; B7 -0.75,5.095; B8 -1.75,5.095 | drill 0.6 pad 0.8 long: FIX1 -4.32,0; FIX4 4.32,0 | drill 0.6 pad 1 long: FIX2 -4.32,4.18; FIX3 4.32,4.18 | hole 0.65: 2.89,3.65; -2.89,3.65
FT-POE-MODULE-NOLABEL = drill 1.016 square: 1 0,0 | drill 1.016: 2 2.54,0; 3 5.08,0; 4 7.62,0; MNT1 0,-15.748; MNT2 30.48,-15.748
2X03-ICSP = drill 1.016: 1 -2.54,-1.27; 2 -2.54,1.27; 3 0,-1.27; 4 0,1.27; 5 2.54,-1.27; 6 2.54,1.27
MICRO-SD-SOCKET-PP = smd 0.8 x 1.5: 1 -8.94,10.7; 2 -7.84,10.3; 3 -6.74,10.7; 4 -5.64,10.9; 5 -4.54,10.7; 6 -3.44,10.9; 7 -2.34,10.7; 8 -1.24,10.7 | smd 1.8 x 1.4: CD1 -2.05,0.4; CD2 -7.75,0.4 | smd 1.4 x 1.9: GND1 -0.45,13.55; GND2 -13.6,14.55
HY931147C = drill 1.63 octagon: GND1 3.05,7.745; GND2 3.05,-7.745 | drill 0.9 square: P$1 8.89,5.715 | drill 0.9: P$2 6.35,4.445; P$3 8.89,3.175; P$4 6.35,1.905; P$5 8.89,0.635; P$6 6.35,-0.635; P$7 8.89,-1.905; P$8 6.35,-3.175; P$9 8.89,-4.445; P$10 6.35,-5.715 | drill 1.016: P$11 -4.08,6.625; P$12 -4.08,4.085; P$13 -4.08,-4.085; P$14 -4.08,-6.625 | hole 3.25: 0,5.715; 0,-5.715
0805-LARGE = smd 1.27 x 1.27: 1 -1.016,0; 2 1.016,0
LED-0603 = smd 0.762 x 0.762: A -0.762,0; C 0.762,0
SOT23 = smd 1 x 1.4: 1 -0.95,-1.1; 2 0.95,-1.1; 3 0,1.1
SOT23-3 = smd 0.8 x 0.9: 1 -0.95,-1; 2 0.95,-1; 3 0,1.1
R0603 = smd 0.762 x 0.762: 1 -0.762,0; 2 0.762,0
DPACK = smd 1 x 1.6: 1 -2.28,-4.8; 3 2.28,-4.8 | smd 5.4 x 6.2: 2 0,2.5
SOT-223 = smd 1.219 x 2.235: 1 -2.311,-3.099; 2 0,-3.099; 3 2.311,-3.099 | smd 3.6 x 2.2: 4 0,3.099
SOT89 = smd 0.8 x 1.4: 1 -1.524,-1.905; 3 1.524,-1.905 | smd 0.8 x 1.9: 2 0,-1.651 | smd 2.032 x 3.65: 4 0,0.94
CAY16 = smd 0.5 x 0.65: 1 -1.2,-0.675; 2 -0.4,-0.675; 3 0.4,-0.675; 4 1.2,-0.675; 5 1.2,0.675; 6 0.4,0.675; 7 -0.4,0.675; 8 -1.2,0.675
TACTILE_SMT-6MM = smd 1.524 x 0.762: 1 -2.54,1.905; 2 2.54,1.905; 3 -2.54,-1.905; 4 2.54,-1.905
SJC = smd 1.168 x 1.6: 1 -0.762,0; 2 0.762,0
CRYSTAL-SMD-3X2 = smd 1.3 x 1.1: 1 -1.15,-0.9; 2 1.15,-0.9; 3 1.15,0.9; 4 -1.15,0.9
TVS0603 = smd 0.762 x 0.762: 1 -0.762,0; 2 0.762,0

### Placement (x,y rotation side)
C1  31.27,37.65 0 top
C2  46.9,38.65 270 top
C3  25.91,24 90 top
C4  52.32,8.26 180 top
C5  16.89,10.67 270 top
C6  22.35,3.81 0 top
C7  40.51,14.48 90 top
C8  21,44.5 270 top
C9  38.61,14.48 90 top
C10  26.92,37 0 top
C11  31,35 180 top
C12  31,33.5 180 top
C13  39.12,41.66 270 top
C14  23.75,23.11 270 top
C15  41,39.5 0 top
C16  56.38,39.49 0 top
C17  20.95,27.94 180 top
C18  20.95,22.61 180 top
C19  39,21.5 0 top
C20  35,28.5 180 top
C21  50.67,13.72 270 top
C22  44,26 0 top
C23  47,34 0 top
C24  26.5,28.5 270 top
C25  31.5,28.5 270 top
C26  56.5,42.5 270 top
C27  51.5,42.5 270 top
CD  61.98,8.13 0 top
D1  22.1,10.54 270 top
F1  13.5,34.5 0 top
FID1  49,43 0 top
FID2  55.5,16.5 0 top
FID3  3,24 0 top
IC2  15,43.5 0 top
IC3  25.53,42.55 180 top
IC4  39.83,32.94 0 top
IC5  38.61,44.96 0 top
IC6  55,32.2 180 top
J1  30.23,50.8 180 top
J2  36.83,2.54 0 top
J3  57.15,2.54 0 top
J4  54.61,50.8 180 top
J5  -1.91,8 270 top
J6  1.5,39.1 270 top
J7  37.5,39.3 0 top
J8  25.4,11.43 90 top
J9  64.91,27.89 270 top
J10  52.2,9.78 270 top
J11  7.62,22.86 0 top
L1  35.5,23.5 180 top
L2  28.19,23.11 90 top
L3  35.5,26 180 top
LED1  63.63,40.13 180 top
LED2  48.01,21.34 180 top
LED3  48.01,22.86 180 top
LED4  2.5,50.65 0 top
LED5  2.5,46.76 0 top
LED6  48.01,19.81 180 top
LED7  48.01,18.29 180 top
LED8  48.01,16.76 180 top
LED9  63.63,38.23 180 top
Q1  25.91,34.16 270 top
Q2  63.12,33.78 270 top
R1  8.5,33 90 top
R2  8.5,42.5 270 top
R3  -1.5,-2.5 0 top
R4  31,32 180 top
R5  29,32.75 90 top
R6  62.48,36.58 180 top
R7  19,41 270 top
R8  19,44.5 270 top
R9  41.15,44.96 270 top
R10  36.07,44.96 270 top
REG1  33.91,12.7 180 top
REG2  46.23,10.67 180 top
REG3  46.23,10.67 180 top
RN1  45,22.5 270 top
RN2  45,19 270 top
RN3  5.5,49.5 270 top
RN4  31.3,42 0 top
RN5  20.45,25.27 270 top
RN6  53.21,25.4 0 top
RN7  58.42,8.13 0 top
S1  61.98,43.81 0 top
SJ1  36.32,41.91 0 top
SJ3  40.13,45.21 270 bottom
SJ4  37.08,45.21 270 bottom
SJ5  55.88,28.07 180 bottom
XTL1  29,28.5 90 top
XTL2  54,42.5 90 top
Z1  11.5,40 0 top
Z2  11.5,37.5 0 top

### Tracks (layer width: path | path; a pad name or v marks a point on that pad's centre or on a via)
1V2A  (via drill 0.4)
  Top 0.254: C1.A 31.76,36.75 C11.1 33.26,35 34.07,34.19 IC4.4 36.56,34.19 38.25,32.5 v39,32.5 | L1.2 v33,23.5
  Bottom 0.254: v39,32.5 33,26.5 v33,23.5
1V2D  (via drill 0.4)
  Top 0.254: IC4.13 35.77,28.49 C20.1 v35.76,27.4 34.48,26.12 L3.2 | C15.1 39.5,39.5 38.58,38.58 IC4.45 38.58,36.42 38.75,36.25 39.25,36.25 40,35.5 40,34 40.81,33.19 | C2.A 46.24,36.59 C23.1 45.43,33.19 IC4.31 40.81,33.19 | 40.81,33.19 40.81,31.19 41.58,30.42 IC4.22 41.58,26.66 v42.24,26 C22.1
  Bottom 0.254: v35.76,27.4 37.16,26 v42.24,26
1V2O
  Top 0.254: IC4.14 37.58,27.06 L3.1
  Top 0.305: L3.1 L1.1
3.3V  (via drill 0.4)  (2 unrouted)
  Top 0.254: IC3.2 26.16,43.45 25.38,42.67 23.38,42.67 v22.74,42.04 | J10.4 61.16,15.42 60.83,15.75 59.34,15.75 v58.45,16.64 | IC2.5 IC2.6 16.9,41.6 | 16.9,41.6 v17.7,41.6 | IC2.7 16.9,41.6 | LED4.A 1.5,50.42 v1.5,48.75 1.5,46.99 LED5.A | IC4.36 44.28,36.28 v44.5,36.5 | 42.75,28.5 IC4.24 | REG3.2 46.23,13.5 | v54.5,14 53.9,14.61 50.63,14.61
  Top 0.406: J11.P$13 4.8,18.77 6.98,20.95 14.61,20.95 15.88,19.68 22.48,19.68 23.74,20.95 27.04,20.95 L2.1 30.29,20 38.5,20 42.5,16 45.63,16 46.23,15.4 46.23,13.5 | 46.23,10.67 49.15,10.67 49.66,11.18 49.66,14 50.13,14.48 C21.1 | 50.63,14.61 C21.1 | C21.1 50.67,16 49.91,16.76 LED8.A LED7.A LED6.A LED2.A LED3.A 48.77,24.23 46.5,26.5 44.5,28.5 42.75,28.5 | REG3.4 REG3.2
  Top 0.813: J2.4 35.66,3.53 36.2,4.06 38.86,4.06 42.37,7.57 REG2.4 | C4.A 46.91,8.26 REG2.4 | REG3.4 REG2.4 | REG3.4 46.23,10.5 | 46.23,10.67 REG3.4
  Bottom 0.254: v1.5,48.75 1.5,47.05 3.55,45 | 3.55,45 3.5,45 3.5,29.48 J11.P$11 | 3.55,45 7,45 11,41 17.1,41 v17.7,41.6 18.1,42 22.7,42 v22.74,42.04 | v44.5,36.5 46,36.5 47.26,35.24 | v54.5,14 57.14,16.64 v58.45,16.64
  Bottom 0.406: J11.P$13 2.29,18.8 1.52,19.56 1.52,28.7 2.29,29.46 J11.P$11
3V3A  (via drill 0.4)
  Top 0.254: C12.1 33.07,32.19 IC4.8 36.81,32.19 38.08,30.92 IC4.15 38.08,21.66 C19.1 32,21.5 29.37,24.13 L2.2
  Top 0.406: L2.2 26.92,25.4 25.27,25.4 C3.A v23.75,25.4 C14.1
  Bottom 0.406: J11.P$4 15.24,26.04 J11.P$3 23.11,26.04 v23.75,25.4
5V  (via drill 0.4)  (7 unrouted)
  Top 0.203: REG1.2 34.04,10.2 34.04,10.16 | 37.21,13.59 37.08,13.59 v37.21,12.83 | 37.85,12.45 v37.97,12.45 37.97,12.32
  Top 0.254: 64.38,39.19 LED9.A 66.56,38.23 68.07,36.71 68.07,34.48 66.67,33.08 66.67,31.89 66.18,31.39 J9.2 | 64.38,39.19 LED1.A | IC3.8 27.43,41.66 29.72,43.94 v30.99,43.94 30.99,43.42 30.9,43.33 RN4.7 | C10.1 25.91,36.88 25.91,33.4 25.72,33.21 Q1.2 | 58.85,39.19 64.38,39.19 | 29.84,10.41 v29.84,10.16 | 29.72,9.78 29.84,9.65 v29.84,9.4 | v29.84,7.87 v29.84,8.64 30.23,8.64 | 36.45,6.48 36.7,6.48 36.83,6.35 36.45,6.35 | 50.29,25.65 50.29,17.53 51.56,16.26 v51.56,16 | C16.1 55.62,39.37 | REG2.3 44.7,12.98 REG3.3 | v30.99,46.22 35.57,46.22 R10.1 36.51,46.16 IC5.6 37.66,45.65 38.1,45.21 39.89,45.21 40.39,45.72 R9.1 | R7.2 19,38.5 17.15,36.65 | C7.1 41.27,13.72 v41.66,14.1
  Top 0.406: 38.57,13.59 C9.1 | IC3.8 27.43,38.99 26.15,37.71 C10.1 | REG3.3 v43.81,12.57
  Top 0.61: v8.76,12.7 4.57,12.7 1.8,15.47 1.8,19.71 2.79,20.7 3.68,20.7 10.98,28 12,28 13.5,29.5 13.5,36.12 14.38,37 16.8,37 17.15,36.65 17.5,36.3 17.5,34 18.29,33.21 Q1.2 | v36.2,5.84 v35.43,5.84 v34.67,5.84 v33.91,5.84 v33.15,5.84 v32.38,5.84 | v36.2,5.84 36.2,6.1 36.45,6.1 | 36.45,6.48 36.45,6.35 36.45,5.84 v36.2,5.84 | 30.23,10.67 30.23,10.54 v30.61,10.54
  Top 0.813: 37.21,13.59 38.57,13.59 | v30.61,7.49 v30.61,10.54 v30.61,12.83 30.86,12.83 | v37.21,7.49 v37.21,8.26 v37.21,9.02 37.21,12.32 v37.21,12.83 | 43.92,12.68 v43.81,12.57 v43.18,12.57
  Top 1.016: C6.+ 26.6,5.37 28.96,5.37 | REG1.2 30.23,6.86 | 30.23,6.86 28.96,5.37 | 34.04,15.24 34.04,10.16 | 34.04,15.24 30.24,15.24 28.96,13.96 28.96,5.37 | 29.34,9.78 29.08,8.89 | 29.34,9.78 29.34,5.71 37.21,5.71 | 37.21,5.71 37.21,12.32 | 37.21,12.32 37.21,13.59 37.21,15.24 34.04,15.24 | 29.34,9.78 29.72,9.78 30.86,10.92 30.86,12.83 32.64,14.61 36.45,14.61 36.45,6.48 30.23,6.48 30.23,6.86 | 30.23,6.86 30.23,8.64 30.99,9.4 30.99,6.99 35.94,6.99 35.94,13.84 32.26,13.84 32,13.59 36.07,13.59 | 29.84,10.41 29.84,12.19 30.23,12.19 30.23,10.67 | 37.21,5.71 37.47,5.71 39.24,7.49 39.24,9.78 38.73,10.29 38.73,12.32 38.61,12.32 | 37.97,12.32 38.61,12.32 | 37.21,12.32 37.97,12.32 | 37.97,12.32 v37.97,11.68 v37.97,10.92 v37.97,10.16 v37.97,9.4 v37.97,8.64 v37.97,7.87 37.97,6.73 | 38.61,12.32 38.61,6.99 | 31.24,11.18 31.24,9.91 29.97,9.91 29.97,9.4 | 29.97,9.4 29.97,9.14 | v29.84,9.4 29.97,9.4 | v29.84,12.45 29.64,12.65 | 29.64,12.65 29.5,12.79 29.5,13.5 30.5,14.5 31.5,14.5 31.5,13 | 29.64,12.65 31,14
  Bottom 0.254: v41.66,14.1 41.7,14.1 42.16,13.63 42.16,13.84 42.29,13.97 42.29,14.35 | 42.42,13.34 42.44,13.35 | 42.29,13.21 42.16,13.34 | 40.26,14.73 40.39,14.86 40.64,14.86 | 21.97,12.7 21.84,12.57 21.84,12.45 | 21.84,11.94 21.97,11.81 21.97,11.56 21.84,11.56 | 21.97,11.18 21.84,11.18 | 21.97,10.92 21.84,10.79 21.84,10.41 | 15.11,10.41 17.02,10.29 15.62,10.03 15.88,9.78 15.88,9.65 16.26,9.27 16.51,9.02 16.51,8.89 | 17.27,8.13 17.27,7.87 | 21.21,14.1 21.21,13.84 | v29.84,11.68 v29.84,12.45 | v29.84,10.92 30.23,10.54 v30.61,10.54 | 36.83,6.35 35.69,6.35 35.56,6.48 | v30.99,46.22 v30.99,43.94 | 48.91,14.1 49.66,14.1 v51.56,16
  Bottom 0.305: v41.66,14.1 48.91,14.1
  Bottom 0.61: 9.78,12.7 9.78,11.81 arc90 10.29,11.18 11.81,11.18 arc-90 17.02,6.35 | 17.02,6.35 17.45,9.86 | 17.45,9.86 19.81,7.49 v30.61,7.49 | 41.17,16.26 41.1,16.08 | 42.42,13.46 42.42,13.34 42.29,13.21 42.16,13.08 39.5,13.08 | 42.29,14.35 42.16,14.48 | 42.16,14.48 40.77,15.88 | 42.16,13.84 40.64,15.37 | 42.16,13.34 40.64,14.86 | 40.26,14.73 41.78,13.21 | 17.45,9.86 26.37,9.86 arc90 27.18,10.67 27.18,15.49 arc-90 27.94,16.26 41.17,16.26 | 41.17,16.26 42.42,15.01 42.42,13.46 | 42.42,13.46 arc-90 41.91,12.95 40.64,12.95 arc90 39.62,11.94 39.62,11.68 | 39.62,11.18 39.62,10.92 arc90 40.64,9.91 45.97,9.91 arc-90 46.74,9.14 | 42.67,5.59 42.67,4.83 arc-90 41.91,4.06 17.78,4.06 arc-90 17.02,4.83 17.02,5.08 | 46.74,6.48 arc-90 46.35,6.1 43.18,6.1 | 46.74,6.99 46.74,7.49 | 46.74,8.13 46.74,8.64 | 17.02,6.1 17.02,5.59 | 17.02,6.6 17.02,7.11 | 17.02,7.62 17.02,9.14 | 17.02,9.14 arc-90 17.78,9.91 27.18,9.91 | 27.18,9.91 27.94,9.91 | 27.94,9.91 27.94,7.48 | 17.02,9.14 46.74,9.14 | 46.74,9.14 46.74,8.64 | 46.74,8.64 17.27,8.64 17.27,8.13 46.74,8.13 | 46.74,7.49 46.74,8.13 | 17.02,7.62 46.74,7.49 | 17.02,7.11 17.02,7.62 | 17.02,7.11 46.74,6.99 | 46.74,6.48 46.74,6.99 | 17.02,6.6 46.74,6.48 | 17.02,6.35 17.02,6.6 | 17.02,6.35 17.02,6.1 | 17.02,6.1 43.18,6.1 | 43.18,6.1 arc90 42.67,5.59 | 17.02,5.59 42.67,5.59 | 17.02,5.59 17.02,5.08 | 17.02,5.08 42.42,5.08 42.42,4.57 17.53,4.57 17.27,7.87 | 17.27,7.87 17.14,9.53 | 17.14,9.53 42.16,9.4 42.16,9.65 39.62,9.65 39.62,9.91 27.94,9.91 | 27.18,9.91 27.18,10.16 39.62,10.16 39.62,10.67 27.43,10.67 27.43,11.18 39.62,11.18 | 39.62,11.18 39.62,11.68 | 39.62,11.68 v29.84,11.68 27.43,11.68 27.43,12.19 39.37,12.19 39.37,12.45
  Bottom 0.61: 39.37,12.45 39.62,12.45 | 39.37,12.45 v29.84,12.45 27.43,12.45 27.43,12.95 39.62,12.95 39.62,13.46 27.43,13.46 27.43,13.97 42.16,13.97 42.16,14.48 | 42.16,14.48 27.43,14.48 27.43,14.99 41.91,14.99 41.91,15.24 41.15,15.24 | 41.15,15.24 27.43,15.24 27.43,15.75 41.15,15.75 41.15,15.24 | 22.99,9.91 arc-90 21.97,10.92 21.97,11.18 21.97,11.56 21.97,12.7 | 21.97,13.34 21.97,12.95 | 21.97,12.95 21.97,12.7 | 21.97,13.34 arc90 21.21,14.1 13.84,14.1 arc90 13.08,13.34 13.08,13.46 arc-90 12.32,12.7 9.78,12.7 | v8.76,12.7 9.78,12.7 | 13.46,13.84 21.21,13.84 21.46,13.84 | 21.97,13.34 13.34,13.34 | 21.97,12.95 12.95,12.95 | 21.97,12.7 12.57,12.7 | 21.84,12.45 10.03,12.45 | 21.84,11.94 10.03,11.94 | 21.84,11.56 10.16,11.56 | 21.84,11.18 13.59,11.18 | 21.84,10.79 14.48,10.79 | 15.11,10.41 21.84,10.41 21.97,10.41 | 15.62,10.03 24.77,10.03 | 17.14,9.53 46.48,9.53 | 17.27,7.87 46.61,7.87 | 15.88,9.65 23.62,9.65 | 16.26,9.27 24,9.27 | 16.51,8.89 24.26,8.89
  Bottom 0.813: 38.1,6.6 37.97,6.6 v37.21,7.49 v37.21,8.26 v37.21,9.02 | v30.61,7.49 v30.61,8.26 v30.61,9.02 v30.61,9.78 v30.61,10.54 v30.61,11.3 | v30.61,12.06 v30.61,12.83 30.73,11.68 30.86,11.56 30.86,11.3 | v37.21,12.83 v37.21,12.06 v37.21,11.3 v37.21,10.54 v37.21,9.78 | v37.21,12.83 37.08,13.59 37.21,13.72 v37.21,12.83 | 43.22,12.57 v43.81,12.57 | 43.22,12.57 v43.18,12.57 | 43.22,12.57 42.44,13.35 42.16,13.63 37.88,13.63 v37.21,12.83 | J2.5 38.1,6.35 36.83,6.35 36.45,6.35 | J2.2 30.48,5.84 v32.38,5.84
  Bottom 1.016: 36.83,6.35 36.7,6.35 v36.2,5.84
A0_D14  (1 unrouted)
  Bottom 0.254: 57.4,24.26 59.94,21.72 59.94,16.1 58.42,14.58 58.42,8.51 53.91,4 52.26,4 J3.1
A1_D15  (1 unrouted)
  Bottom 0.254: 57.91,24.51 60.45,21.97 60.45,15.85 58.93,14.32 58.93,8.13 J3.2
A2_D16  (1 unrouted)
  Bottom 0.254: 60.33,28.61 60.33,22.86 61,22.18 61,19.2 62,18.2 62,15.06 59.44,12.5 59.44,7.7 55.88,4.14 J3.3
A3_D17  (1 unrouted)
  Bottom 0.254: J3.4 58.42,5.84 59.94,7.36 59.94,12.25 62.5,14.8 62.5,18.5 61.5,19.5 61.5,22.45 60.83,23.11 60.83,29.27
A4_D18  (2 unrouted)
  Bottom 0.254: 61.34,29.56 61.34,23.37 62,22.71 62,19.8 63,18.8 63,10.53 63.25,10.29 63.25,4.83 J3.5 59.69,1.27 50.04,1.27 49.53,1.78 49.53,4.83 53.09,8.39 53.09,15.09 53.5,15.5 53.5,17.37 49.45,21.41 49.45,25.4 | 40.39,45.72 42.67,45.72 43.5,44.89 43.5,44.13 50.03,37.6
A5_D19  (via drill 0.4)  (3 unrouted)
  Top 0.254: v62.06,31.5 61.98,31.5
  Bottom 0.254: 49.02,35.35 44.48,39.89 40.59,39.89 38.61,41.86 38.61,45.62 38.25,45.97 | v62.06,31.5 61.85,31.29 61.85,23.62 62.5,22.97 62.5,20.1 63.5,19.1 63.5,10.79 63.75,10.54 63.75,4.35 63.5,4.1 J3.6 61.72,0.76 49.78,0.76 49.02,1.52 49.02,5.09 52.58,8.64 52.58,15.22 52.93,15.57 52.93,17.18 48.5,21.6
  Bottom 0.305: 25.15,48.77 25.4,48.77
ACTLED
  Top 0.254: IC4.20 40.58,25.42 43.1,22.9 RN1.2
AREF  (via drill 0.4)  (1 unrouted)
  Top 0.254: v49.78,48.26 28.7,48.26 28.45,48.01 24.89,48.01 23.88,49.02 | 23.88,49.02 J1.8 | C8.1 21,46.15 23.88,49.02
  Bottom 0.254: 55.12,38.47 49.53,44.06 49.53,47.37 49.78,47.62 v49.78,48.26
COLLED
  Top 0.254: IC4.21 41.08,25.92 43.3,23.7 RN1.1
D0_RX  (via drill 0.4)  (1 unrouted)
  Top 0.254: v18.14,47.77 17.53,48.39 17.53,51.42 18.81,52.7 61.59,52.7 J4.1 | RN3.4 v3.9,48.3
  Bottom 0.254: J4.1 63.5,37.56 | v3.9,48.3 6,48.3 6.8,47.5 17.88,47.5 v18.14,47.77
D1_TX  (via drill 0.4)  (1 unrouted)
  Top 0.254: J4.2 59.56,52.2 20.9,52.2 20,51.3 v20,47.5 | RN3.3 5.4,49.1 5.5,49 v5.5,47.5
  Bottom 0.254: J4.2 62.87,48.9 62.87,37.85 | v5.5,47.5 6,47 19.5,47 v20,47.5
D2_RX1  (1 unrouted)
  Bottom 0.254: 62.23,38.15 62.23,46.99 J4.3
D3_TX1  (1 unrouted)
  Bottom 0.254: J4.4 61.59,45.09 61.59,38.61
D4  (2 unrouted)
  Bottom 0.254: 56.92,28.35 56.92,28.07 SJ5.2 | J4.5 60.96,43.18 60.96,39.07
D5  (1 unrouted)
  Bottom 0.254: 54.48,38.35 48.9,43.93 48.9,48.9 J4.6
D6  (1 unrouted)
  Bottom 0.254: 53.72,38.35 48.26,43.81 J4.7
D7  (1 unrouted)
  Bottom 0.254: 53.09,38.22 47.62,43.68 47.62,48.9 J4.8
D8  (1 unrouted)
  Bottom 0.254: 52.45,37.97 46.99,43.43 46.99,48.39 45.97,49.4 43.05,49.4 J1.1
D9  (1 unrouted)
  Bottom 0.254: 51.82,37.71 46.35,43.17 46.35,48.13 45.72,48.77 41.14,48.77 J1.2
D10_CS  (1 unrouted)
  Top 0.254: IC4.29 45.69,32.19 46,32.5 48,32.5
  Bottom 0.254: J1.3 36.58,50.68 34.04,48.14 34.04,44.04 34.49,43.59 35.91,43.59 40.2,39.3 44.2,39.3 48.5,35
D11_COPI  (via drill 0.4)  (3 unrouted)
  Top 0.254: 62.1,26.67 64.52,26.67 65.74,27.89 J9.4 | IC4.32 41.81,33.69 v41,34.5
  Bottom 0.254: J1.4 33.02,49.78 33.02,42.67 33.91,41.78 33.91,39.27 36.17,37 40,37 41,36 | v41,34.5 41,36 | 41,36 42.5,36 44,34.5 44,32 47.5,28.5
D12_CIPO  (via drill 0.4)  (2 unrouted)
  Top 0.254: J10.7 62.9,12.16 62.87,12.19 v64.26,12.19 | IC4.33 42.81,34.19 v42,35
  Bottom 0.254: J1.5 32.51,49.78 32.51,42.16 33.4,41.27 33.4,38.89 35.79,36.5 39.5,36.5 40,36 40,34 40.5,33.5 41.5,33.5 41.75,33.75 | v42,35 42,34 41.75,33.75 | 41.75,33.75 43,32.5 43,32 47,28 | v64.26,12.19 64.26,13.74 64,14 64,19.4 63,20.4 63,23.23 62.36,23.88 62.36,29.17 63.61,30.43 J9.1 63.64,31.46 62.7,32.4
D13_SCK  (via drill 0.4)  (4 unrouted)
  Top 0.254: J9.3 64.9,29.15 64.9,29.21 | 64.9,29.21 64.9,30.99 66.17,32.26 66.17,32.92 65.81,33.27 65.15,33.27 64.77,32.89 63.6,32.89 63.25,33.25 63.25,34.24 62.75,34.73 Q2.1 | 64.9,29.21 66.8,29.21 67.44,28.57 67.44,27.18 66.9,26.64 65.58,26.64 64.9,25.96 64.9,24.51 65.15,24.26 65.15,22.73 64.02,21.59 | v41.75,32 42.44,32.69 IC4.30
  Bottom 0.254: 51,27 50.5,27.5 | 46.25,27.5 v41.75,32 41,32 39.5,33.5 39.5,35.54 39.04,36 35.5,36 32.89,38.61 32.89,40.77 32,41.66 32,47.75 J1.6
D+
  Top 0.254: J6.B6 5.45,38.35 5.2,38.6 5.2,39.1 5.45,39.35 J6.A6 9.09,39.35 9.74,40 Z1.1 10.74,39.26 11,39 14,39 14.75,39.75 IC2.3
D-  (via drill 0.4)
  Top 0.254: J6.A7 8.15,38.85 v8.5,38.5 9.5,37.5 Z2.1 10.74,38.24 11,38.5 14.3,38.5 15.25,39.45 IC2.4 | J6.B7 8.1,39.85 v8.5,40.25
  Bottom 0.254: v8.5,38.5 v8.5,40.25
DTR  (via drill 0.4)
  Top 0.254: v34.42,42.67 34.83,42.67 35.56,41.94 SJ1.1 | IC2.23 11.71,42.75 v11.65,42.69
  Bottom 0.254: v34.42,42.67 33.53,43.56 33.53,48.51 35.31,50.28 35.31,52.2 34.8,52.7 18.8,52.7 17.5,51.41 17.5,49.5 16.5,48.5 7.8,48.5 6.8,49.5 3.3,49.5 2.7,48.9 2.7,47.3 4,46 8.34,46 v11.65,42.69
FDXLED
  Top 0.254: IC4.19 40.08,25.27 44.05,21.3 RN1.4 44.7,21.3 45,21 45,20.5 45.3,20.2 RN2.8
GND  (via drill 0.4)  (126 unrouted)
  Top 0.254: RN7.1 57.22,6.92 57.28,6.86 58.02,6.86 | RN7.3 58.8,7.43 58.8,6.99 58.67,6.86 58.02,6.86 | RN7.2 58.02,6.86 | J10.6 61.73,13.22 v61.34,12.06 | Q2.2 62.55,32.83 63.12,32.26 65.15,32.26 v65.41,32.51 | v67.44,32.51 68.07,31.88 68.07,25.65 67.77,25.35 J9.6 | REG2.1 48.54,13.36 REG3.1 | IC2.2 14.25,42.75 IC2.TGND | 43,31.19 43,31.69 IC4.28 45.5,31.69 45.5,31.19 | 43,31.19 IC4.27 45.5,31.19 | 43,31.19 43,30.69 IC4.26 45.19,30.69 45.5,31 45.5,31.19 | RN6.1 52,24.74
  Top 0.406: v50.67,11.18 C21.2 | 38.61,15.37 38.61,15.49 37.85,16.26 36.7,16.26 36.2,16.76 REG1.1 | 38.61,15.37 C9.2 | 38.61,15.37 40.47,15.37 C7.2 | J6.A1B12 6.59,43.41 6.5,43.5 5.76,43.5 J6.FIX2 | J6.A12B1 6.59,35.09 6.28,34.78 J6.FIX3
  Top 0.61: J9.6 66.75,24.78 J10.GND2
  Top 1.016: REG1.1 34.32,17.5 v34.29,17.53
  Bottom 0.254: v67.44,32.51 v65.41,32.51
  other vias: 65.66,4.45 22.35,21.34 58.78,40.38 58.29,20.2 23.7,47.12 31.8,24.5 31.8,25.5 38.05,17.53 29.44,39.73 35.31,46.99 43.42,47.11 51.68,21.6 52.94,20.1 65.15,20.7 65.15,19.44 65.02,49.3 52.2,48.51 5.21,25.78 25.91,2.29 49,7 55.15,10.75 56.5,14 24.13,27.68 15.11,28.32 14.99,23.5 10.8,25.54 9.8,24.76 21.46,21.34 20.57,21.34 19.68,21.34 19.05,15.11 18.03,15.11 17.02,15.11 16,15.11 54.16,10.75 56.5,13 60.83,6.73 17.02,1.78 18.28,1.78 30.24,47.24 45.22,44.16 34.8,45.47 14,8 43.5,37 44.5,41.5 28.74,44.74 8.8,49.45 48.94,15.6 47.94,15.6 29.96,22.34 38.96,22.84 17.4,39.3 21.5,39
  pour Bottom: 0,50.8 arc-74 2.54,53.34 63.5,53.34 arc-74 66.04,50.8 66.04,40.64 68.58,38.1 68.58,5.08 66.04,2.54 arc-74 63.5,0 2.54,0 arc-74 0,1.91
  pour Top: 0,50.8 arc-74 2.54,53.34 63.5,53.34 arc-74 66.04,50.8 66.04,40.64 68.58,38.1 68.58,5.08 66.04,2.54 arc-74 63.5,0 2.54,0 arc-74 0,1.91
LINKLED
  Top 0.254: IC4.17 39.08,24.42 42,21.5 42,18.5 42.7,17.8 RN2.4 44.8,17.8 45,18 45,19 45.4,19.4 RN2.7
N$1
  Top 0.305: RN5.6 21.84,24.87 21.84,24.13 | 21.84,24.13 21.12,24.13 RN5.5 | C18.1 21.84,22.61 21.84,24.13
N$2  (1 unrouted)
  Top 0.254: C26.2 56.13,41.37 | 56.13,41.37 56.11,41.35 | XTL2.1 54.92,41.37 56.13,41.37
N$3
  Top 0.254: SJ1.2 37.59,42.42 C13.1
N$4  (1 unrouted)
  Top 0.254: 61.72,37.08 LED9.C
N$5  (via drill 0.4)
  Top 0.254: IC5.1 36.51,43.76 R10.2 35.81,44.45 v35.05,44.45
  Bottom 0.254: SJ4.2 v35.05,44.45
N$6
  Top 0.254: Q2.3 64.14,33.87 64.14,34.42 63.51,35.01 63.25,35.27 R6.1
N$7  (1 unrouted)
  Top 0.254: 51.5,40.5 C27.2 53.1,43.34 XTL2.3
N$8
  Top 0.254: LED3.C 46.4,23.7 RN1.8
N$9  (1 unrouted)
  Top 0.254: IC4.47 37.58,39.22 J7.1
N$10  (via drill 0.4)
  Top 0.254: J6.B5 7.85,37.35 v8,37.5 | R1.2 v8.5,35
  Bottom 0.254: v8.5,35 8.5,37 v8,37.5
N$11
  Top 0.254: LED5.C 3.26,47.36 2.79,47.82 2.79,48.98 3.48,49.66 4,49.66 4.24,49.9 RN3.2
N$12
  Top 0.254: RN4.5 32.5,43.25 32.32,43.43 31.81,43.43 | 31.81,43.43 31.68,43.31 31.68,42.6 RN4.6 | IC3.3 24.89,46.48 25.47,47.06 28.12,47.06 30.18,45 31.41,45 31.81,44.6 31.81,43.43
N$13
  Top 0.254: RN3.1 4.78,50.65 LED4.C
N$14  (via drill 0.4)  (1 unrouted)
  Top 0.254: LED1.C 62.88,40.78 63.12,41.02 64.82,41.02 65.31,40.54 65.31,39.6 v65.91,38.99
  Bottom 0.254: v65.91,38.99 65.91,38.35 63.31,35.75 63.31,33.47 65.15,31.62 66.8,31.62 67.44,30.99 67.44,24.51 66.55,23.62 v63.75,23.62
N$15
  Top 0.406: 35.81,41.91 36.83,41.91
N$18
  Top 0.254: IC3.6 24.89,38.48 | 24.89,38.48 25.78,38.48 26.16,38.86 IC3.7 | Q1.1 24.89,35.2 24.89,38.48
N$19
  Top 0.254: IC3.5 23.62,41.27 24.38,42.04 25.74,42.04 27.43,43.73 IC3.1
N$20  (via drill 0.4)  (1 unrouted)
  Top 0.254: 54.41,22.68 RN6.4 | 59.44,17.65 v61.21,17.65 62.46,17.65 J10.2 | RN7.8 57.22,11.5 v59.94,14.22
  Bottom 0.254: v59.94,14.22 61.21,15.49 v61.21,17.65
N$23
  Top 0.254: J10.CD1 55.51,11.83 56.01,11.33 56.01,6.59 56.9,5.7 61.2,5.7 61.98,6.48 CD.1
N$24
  Top 0.254: RN6.2 52.81,22.5 57.69,17.63 57.69,15.72 58.29,15.11 60.33,15.11 61.21,14.22 | 61.21,14.22 62.8,14.22 J10.5 | RN7.7 58.02,11.03 61.21,14.22
N$25
  Top 0.254: RN6.3 53.61,22.59 59.69,16.51 62.89,16.51 J10.3 64.57,16.51 65.15,15.93 65.15,11.94 64.06,10.85 64.06,10.49 63.61,10.03 59.44,10.03 58.82,9.42 RN7.6
N$26
  Top 0.254: LED7.C 46.93,18.6 RN2.6
N$27  (1 unrouted)
  Top 0.254: RN6.5 54.41,26.15
  Bottom 0.254: 54.84,27.79 SJ5.1
N$28
  Top 0.254: LED8.C 46.58,16.76 45.67,17.67 RN2.5
N$29  (via drill 0.4)
  Top 0.254: IC5.3 40.71,43.76 R9.2 41.4,44.45 v42.16,44.45
  Bottom 0.254: SJ3.2 v42.16,44.45
N$30
  Top 0.254: IC4.11 35.36,30.67 29.12,30.67 XTL1.3 27.71,29.26 C24.1
N$32
  Top 0.254: IC4.12 32.43,30.19 C25.1 29.9,27.66 XTL1.1
N$34
  Top 0.254: J6.A5 6.62,40.37 7.46,40.37 7.65,40.56 7.65,40.89 R2.2
N$35
  Top 0.254: R4.2 30.23,31.99 R5.1
N$36
  Top 0.254: R4.1 32.07,31.69 IC4.9
N$39
  Top 0.254: IC2.8 18.01,42.75 | 18.01,42.75 R7.1 | R8.2 18.01,42.75
N$60
  Top 1.016: J5.PWR 11.79,9 13.46,10.67 20.07,10.67 D1.A
N$67  (via drill 0.4)
  Top 0.254: v43.31,20.77 43.76,20.77 RN2.1
  Bottom 0.254: J11.P$14 5.33,18.03 5.33,20.81 2.29,23.86 2.29,27.49 2.99,28.19 4.7,28.19 11.94,20.95 14.61,20.95 15.88,19.68 23,19.68 24.01,20.7 43.24,20.7 v43.31,20.77
N$68
  Top 0.813: J11.P$9 23.37,18.41 25.15,16.51 J8.3
N$69
  Top 0.813: J11.P$10 14.99,17.14 15.75,16.38 22.73,16.38 25.15,13.97 J8.2
N$115
  Top 0.305: J6.A4B9 6.54,41.6 5.98,41.6 4.6,40.22 4.6,38 5.95,36.65 J6.A9B4
  Top 0.406: 8.85,36.65 J6.A9B4
  Top 0.61: 8.85,36.65 9.85,36.65 11.55,34.95 F1.1
N$321
  Top 0.305: RN5.7 21.84,25.67 21.84,26.42 | 21.84,26.42 21.12,26.42 RN5.8 | C17.1 21.84,27.94 21.84,26.42
N$327
  Top 0.254: RN1.5 46.2,21.3 46.5,21 46.5,20.5 47.19,19.81 LED6.C
N$329
  Top 0.254: RN1.7 46.1,22.9 46.5,22.5 46.5,22 47.16,21.34 LED2.C
N$332  (via drill 0.4)
  Top 0.254: v43.31,19.25 44.17,19.25 RN2.2
  Bottom 0.254: J11.P$12 3.54,25.67 3.68,25.53 13.34,15.88 17.27,15.88 19.18,17.78 28.32,17.78 29.79,19.25 v43.31,19.25
RESET  (via drill 0.4)  (1 unrouted)
  Top 0.254: v52.32,4.95 41.15,4.95 39.37,3.17 39.37,1.91 38.73,1.27 34.29,1.27 J2.3 | v58.04,22.48 64.14,22.48 64.52,22.86 64.52,24.1 63.63,24.99 63.63,25.34 J9.5 | 64,41.91 63.09,41.91 62,43 | 64,41.91 S1.4 | v64.26,42.93 64.26,42.17 64,41.91 | 62,43 62,45.8 61.19,46.61 46.35,46.61 43.05,43.3 43.05,41.15 42.38,40.49 39.52,40.49 C13.2 38.72,40.5 36.5,40.5 36.1,40.1 | 62,43 60.91,41.91 S1.3 | RN4.2 30.9,41.6 31.3,42 33.2,42 35.1,40.1 36.1,40.1 | IC4.48 36.61,37.39 36,38 36,40 36.1,40.1
  Bottom 0.254: J9.5 64.9,26.61 64.9,30.99 62.66,33.22 62.66,35.97 64.26,37.56 v64.26,42.93 | v52.32,4.95 53.98,4.95 57.66,8.64 57.66,14.61 59.31,16.26 59.31,21.19 58.04,22.46 v58.04,22.48
RX_LED
  Top 0.254: IC2.13 16.25,46.55 15.3,47.5 13.15,47.5 9.15,51.5 5.93,51.5 5.52,51.09 5.52,51.02 5.5,51 5.5,50.33 5.93,49.9 RN3.7
RXIN  (via drill 0.4)
  Top 0.254: IC4.5 33.31,33.69 v33,34
  Top 0.305: J11.P$2 17.4,27.3 19.03,25.67 RN5.2
  Bottom 0.254: J11.P$2 13.97,28.32 15.62,29.97 28.97,29.97 v33,34
RXIP  (via drill 0.4)
  Top 0.254: IC4.6 34.06,33.19 v33.8,32.93
  Top 0.305: J11.P$1 17.27,28.57 19.37,26.47 RN5.1
  Bottom 0.254: J11.P$1 17.43,29.5 30.37,29.5 v33.8,32.93
SCL  (via drill 0.4)  (2 unrouted)
  Top 0.254: 37.15,48.77 v37.4,49.02
  Bottom 0.254: SJ4.1 37.08,48.77 v37.4,49.02
SDA  (via drill 0.4)  (2 unrouted)
  Top 0.254: v38.61,49.02 37.85,49.78 37.08,49.78 36.58,49.28 v27.69,49.28
  Bottom 0.254: v27.69,49.28 26.16,49.28 25.91,49.53 24.89,49.53 24.64,49.28 22.86,49.28 | v38.61,49.02 40.13,47.5 SJ3.1
SPDLED
  Top 0.254: IC4.18 39.58,24.92 42.5,22 42.5,19 42.98,18.52 43.61,18.52 43.69,18.6 RN2.3
TX_LED
  Top 0.254: IC2.14 15.75,46.25 15,47 13,47 9.3,50.7 RN3.8
TXON  (via drill 0.4)
  Top 0.254: v38.5,35 38.31,35.19 IC4.2
  Top 0.305: J11.P$6 17.4,22.23 19.25,24.07 RN5.4
  Bottom 0.254: J11.P$6 16.9,22.23 18.67,24 28.74,24 38.5,33.76 v38.5,35
TXOP  (via drill 0.4)
  Top 0.254: v37.75,34.25 37.31,34.69 IC4.3
  Top 0.305: J11.P$5 17.89,24.87 RN5.3
  Bottom 0.254: J11.P$5 17.52,24.5 27.98,24.5 37.48,34 v37.75,34.25
USBRXD
  Top 0.254: IC2.21 12,43.75 7.45,48.3 RN3.5
USBTXD
  Top 0.254: IC2.20 12.25,44.25 7.4,49.1 RN3.6
USBVCC
  Top 0.61: Q1.3 27.01,33.15 25.74,31.88 24,31.88 23.62,31.88 17.12,31.88 15.45,33.55 F1.2
VIN  (via drill 0.4)
  Top 0.254: v10.8,24.11 v10.79,24.11 v9.15,22.47 | v11.18,19.93 11.18,17.81 13.11,15.88 13.11,13.75 9.19,9.84 9.19,6.81 10.87,5.13 12.75,5.13 15.89,8.27 C5.+ | RN4.3 31.7,40.66 31.5,40.46 v31.5,39.76
  Top 1.016: REG1.3 31.63,16.52 27.56,16.51 | 27.56,16.51 27.56,9.27 26.42,8.13 22.35,8.13 | J8.4 27.56,19.05 27.56,16.51 | v22.86,2.16 22.35,2.16 | v21.84,2.16 22.35,2.16 | 22.35,2.16 22.35,5.84 22.1,6.1 D1.C 21.89,8.6 22.35,8.13 | C5.+ 17,8.13 22.35,8.13
  Bottom 0.254: v31.5,39.76 31.5,39.7 22.77,30.98 15.23,30.98 12.07,27.82 12.07,25.38 v10.8,24.11 | v9.15,22.47 11.18,20.45 v11.18,19.93
  Bottom 1.016: v21.84,2.16 v22.86,2.16 24.13,0.89 44.07,0.89 J2.8

### Text on the board
tPlace: USB | TX | RX | SCL | SDA | A | GND | 13 | 12 | 11 | 10 | 9 | 8 | 7 | 6 | 5 | 4 | 3 | 2 | 1 | 0 | REF | Digital | TX | RX | Super / House | ~ | ~ | ~ | ~ | ~ | ~ | superhouse.tv/eb | v1.0 | RST | RST / EN | CP2102N | PWR | INT | D13 | EtherBear | by Jon Oxer | 1 | ICSP | A6 | A7 | COL | ACT | FDX | 100 | LNK | PoE | 7-48V | 7-12V | DC | microSD | C | D | 2.1mm | Power | Analog | SDA | SCL | 5V | RST | 3V3 | 5V | GND | GND | VIN | 0 | 1 | 2 | 3 | 4 | 5
bPlace: SKU: EB | SCL | SDA | A | GND | 13 | 12 | 11 | 10 | 9 | 8 | 7 | 6 | 5 | 4 | 3 | 2 | 1 | 0 | I2C | REF | Digital | TX | RX | ~ | ~ | ~ | ~ | ~ | ~ | ISOLATE | MCP 24AA025E48 I2C / ADDR: 70 (0x50) | SDA/SCL | EtherBear | Wiznet Mode / Open: W6100 / Closed: W5500 | Select "Bobuino" / in the Arduino IDE | D4/CS | Super / House | www.superhouse.tv/eb | CC | ROHS | Power | Analog | SDA | SCL | 5V | RST | 3V3 | 5V | GND | GND | VIN | 0 | 1 | 2 | 3 | 4 | 5
tDocu: A | K | A | K | K | A | K | A | K | A | K | A | K | A | K | A | K | A